# EAGLE design Drum_Machine (EAGLE 9.0.0)
REV: 00

## Sheet 1 of 6: PocketBeagle Connections
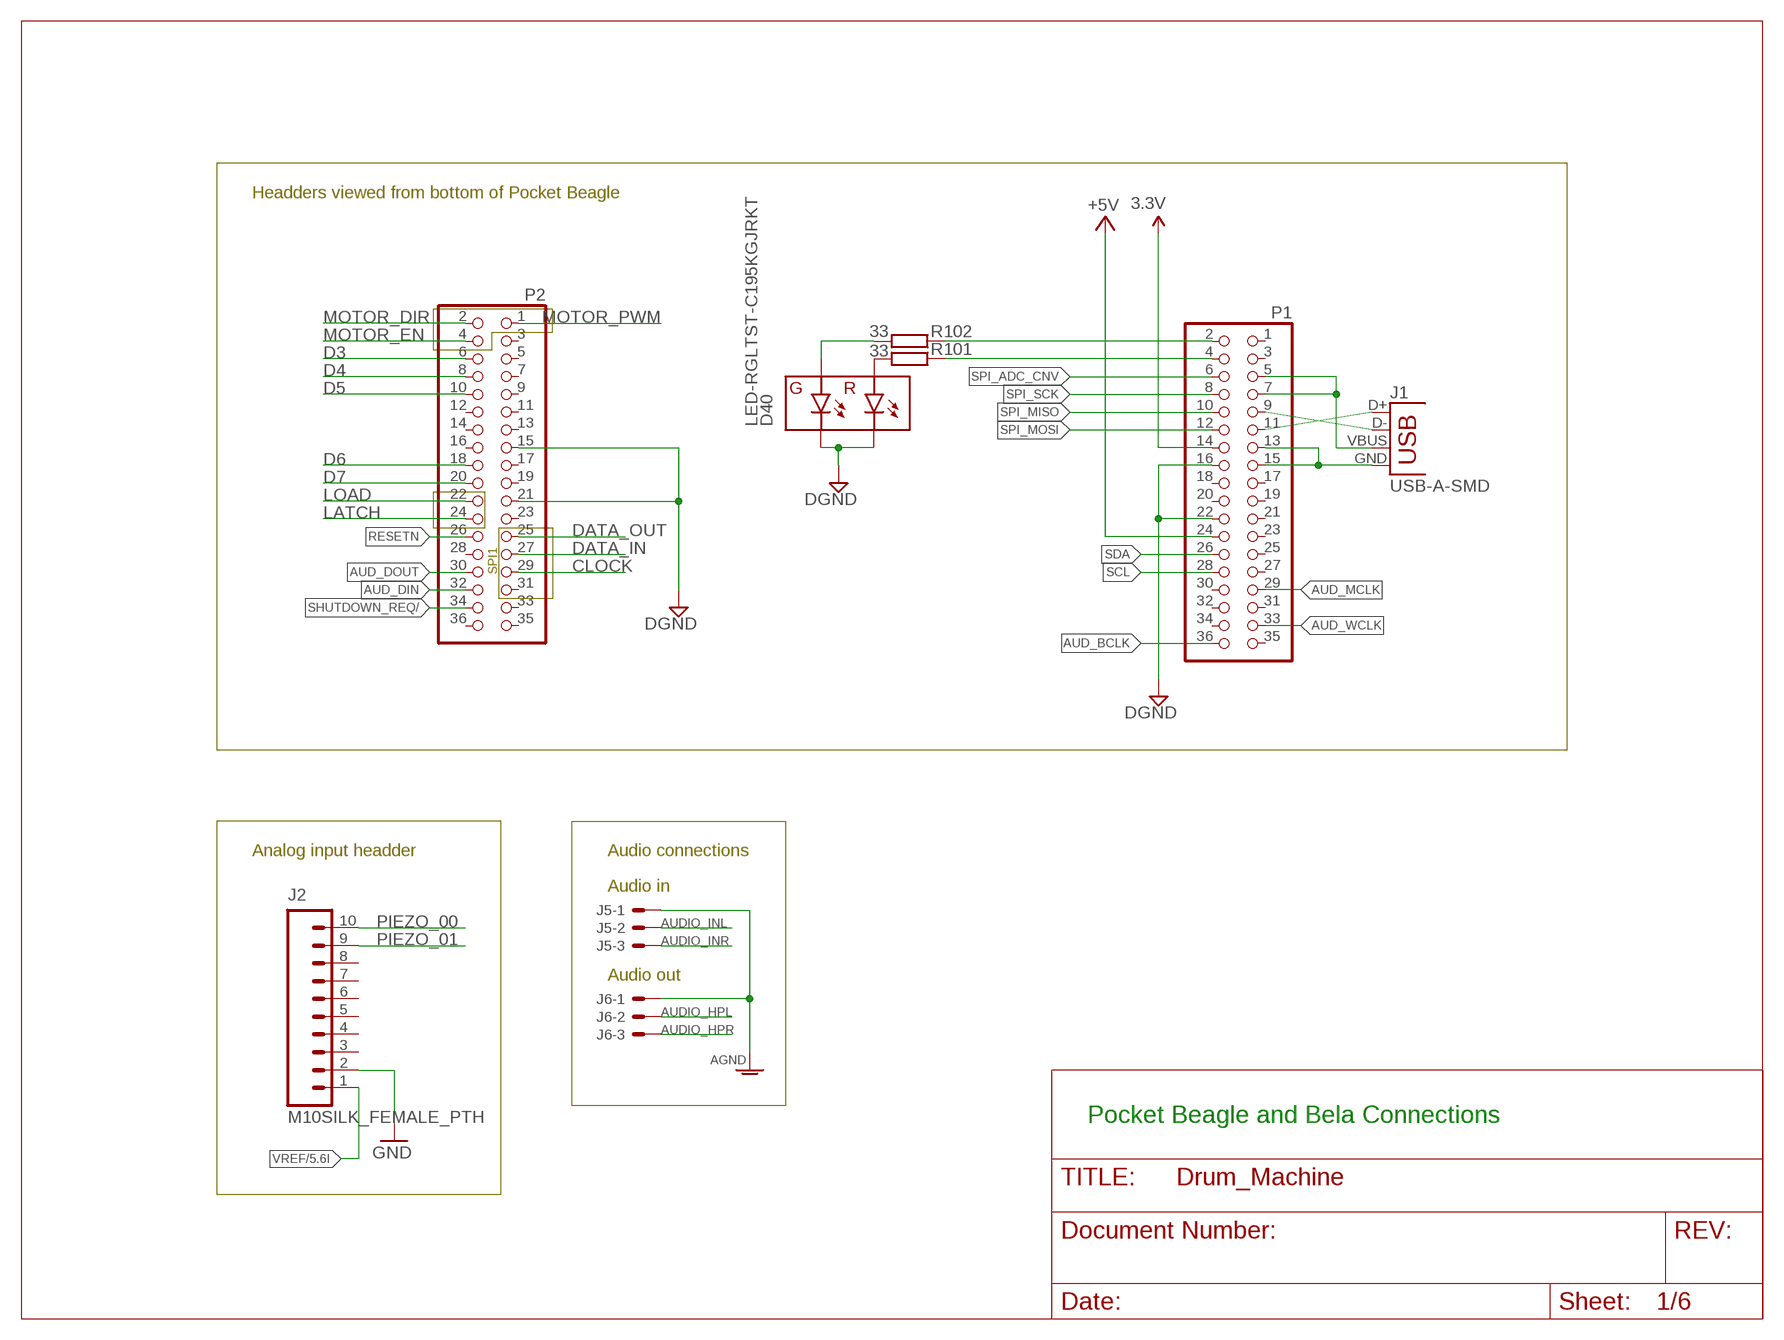
[diagram p0: schematic, sheet 1]

### Parts
D40  LED-RGLTST-C195KGJRKT  [LTST-C195KGJRKT]
J1  USB-A-SMD  [USB-A-S-NOSILK-FEMALE]
J2  M10SILK_FEMALE_PTH  [1X10]
J5  22-23-2031  [22-23-2031]
J6  22-23-2031  [22-23-2031]
P1  PINHD-2X18  [2X18]
P2  PINHD-2X18  [2X18]
R101  33  R-EU_R0603  [R0603]
R102  33  R-EU_R0603  [R0603]

### Nets
3.3V: P1.14 ; also sheet 2,3,4
+5V_SYS: P1.24 ; supply symbol labelled +5V
AUD_BCLK: P1.36
AUD_DIN: P2.32
AUD_DOUT: P2.30
AUD_MCLK: P1.29
AUD_WCLK: P1.33
AUDIO_HPL: J6.2
AUDIO_HPR: J6.3
AUDIO_INL: J5.2
AUDIO_INR: J5.3
CLOCK: P2.29 ; also sheet 2,3,4
D3: P2.6
D4: P2.8
D5: P2.10
D6: P2.18
D7: P2.20
DATA_IN: P2.27
DATA_OUT: P2.25 ; also sheet 2
GND: D40.P$3(GC) D40.P$4(RC) J2.2 J5.1 J6.1 P1.16 P1.22 P2.15 P2.21 ; supply symbol labelled DGND, AGND ; also sheet 2,3,4,5,6
LATCH: P2.24 ; also sheet 2,3
LOAD: P2.22
MOTOR_DIR: P2.2
MOTOR_EN: P2.4
MOTOR_PWM: P2.1
N$134: D40.P$2(RA) R101.2
N$135: D40.P$1(GA) R102.2
N$136: P1.4 R101.1
N$137: P1.2 R102.1
PIEZO_00: J2.10 ; also sheet 5
PIEZO_01: J2.9 ; also sheet 5
RESETN: P2.26
SCL: P1.28
SDA: P1.26
SHUTDOWN_REQ/: P2.34
SPI_ADC_CNV: P1.6
SPI_MISO: P1.10
SPI_MOSI: P1.12
SPI_SCK: P1.8
USB_DM1: J1.D- P1.9
USB_DP1: J1.D+ P1.11
USB_VBUS1: J1.VBUS P1.5 P1.7
USBGND1: J1.GND P1.13 P1.15
VREF: J2.1 ; also sheet 5
Unconnected: J2.3 J2.4 J2.5 J2.6 J2.7 J2.8 P1.1 P1.3 P1.17 P1.18 P1.19 P1.20 P1.21 P1.23 P1.25 P1.27 P1.30 P1.31 P1.32 P1.34 P1.35 P2.3 P2.5 P2.7 P2.9 P2.11 P2.12 P2.13 P2.14 P2.16 P2.17 P2.19 P2.23 P2.28 P2.31 P2.33 P2.35 P2.36

### Notes on the sheet
- Headders viewed from bottom of Pocket Beagle
- SPI1
- Analog input headder | Audio connections
- Audio in
- Audio out
- Pocket Beagle and Bela Connections

## Sheet 2 of 6: LED Matrix
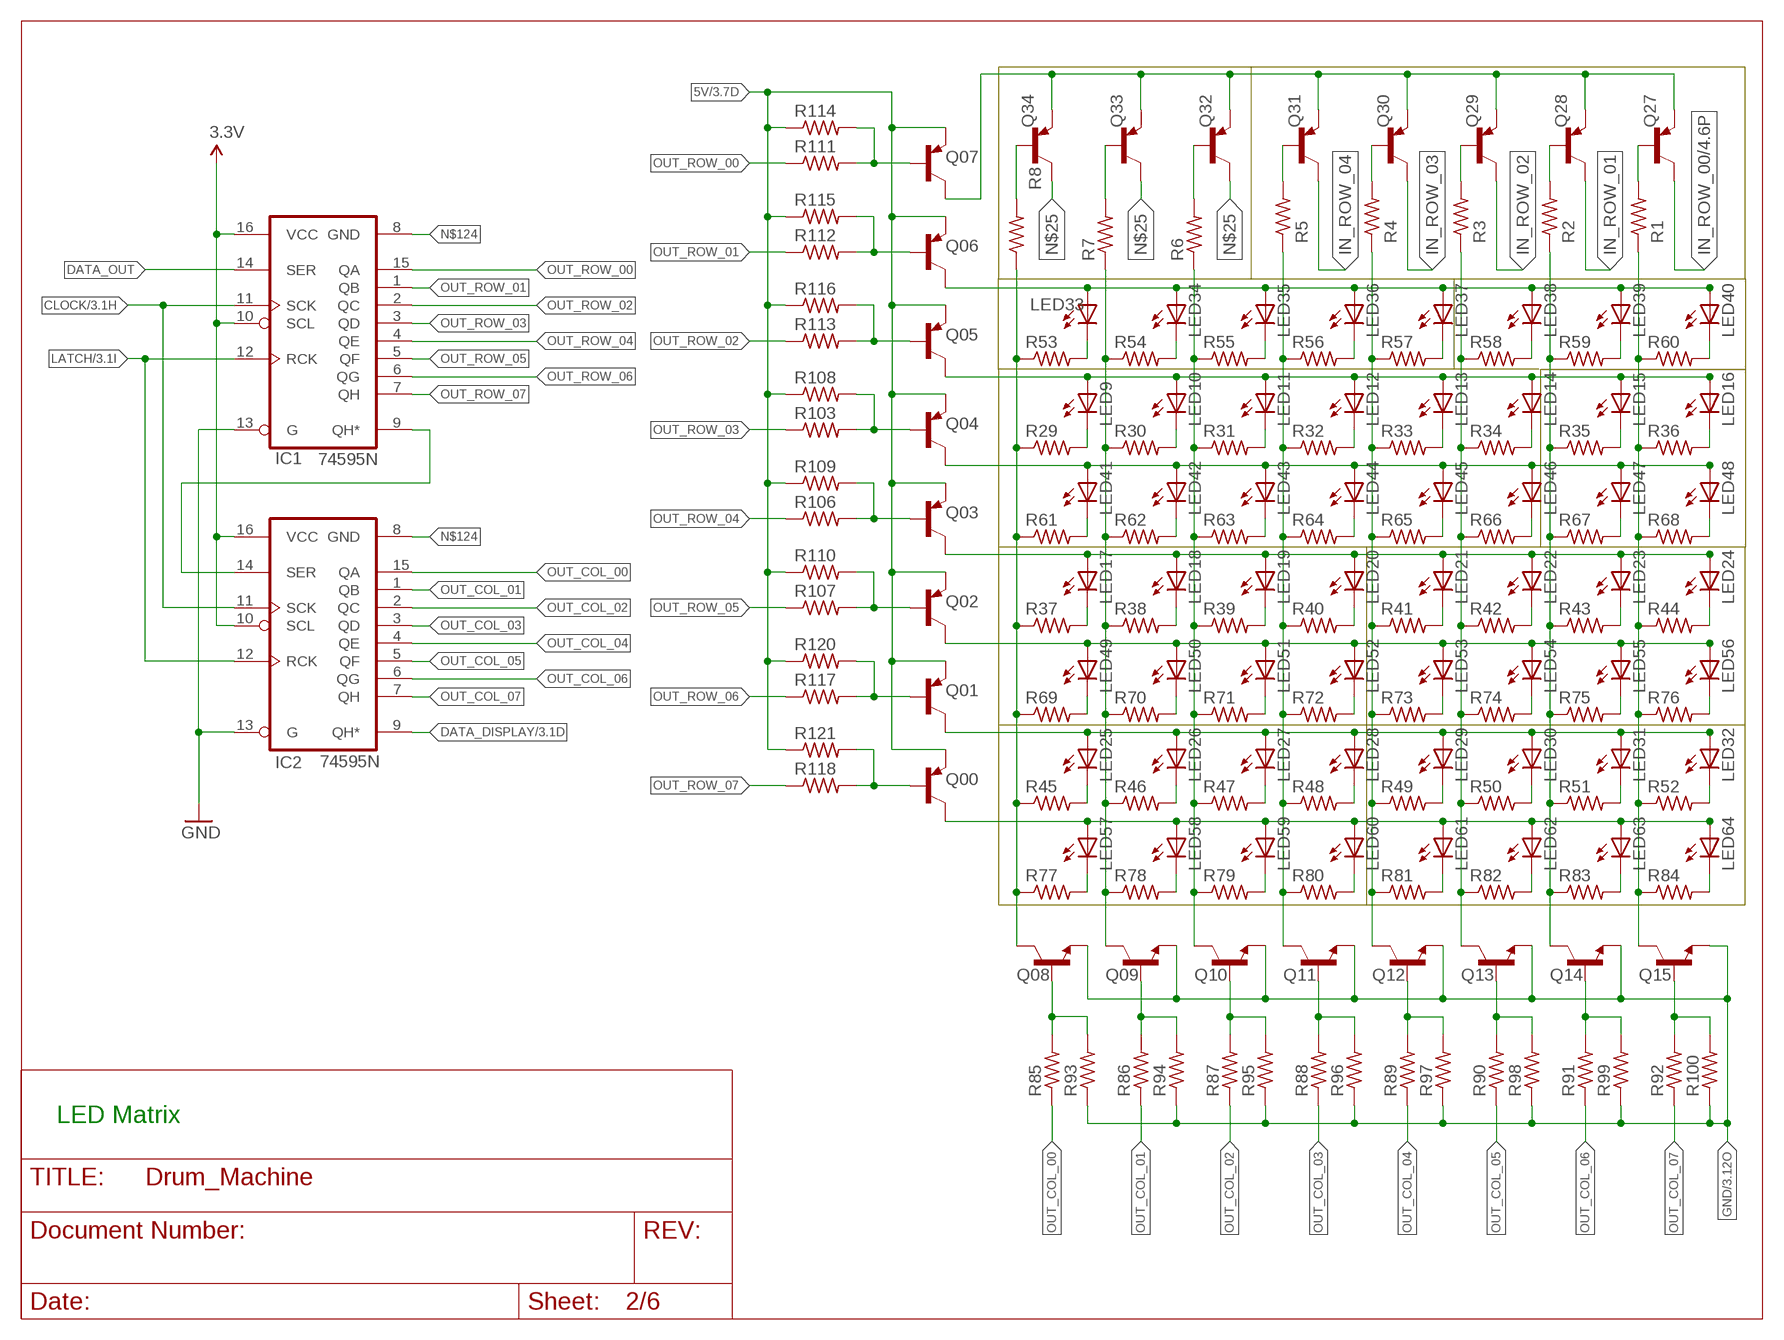
[diagram p1: schematic, sheet 2]

### Parts
IC1  74595N  [DIL16]
IC2  74595N  [DIL16]
LED9  LED5MM  [LED5MM]
LED10  LED5MM  [LED5MM]
LED11  LED5MM  [LED5MM]
LED12  LED5MM  [LED5MM]
LED13  LED5MM  [LED5MM]
LED14  LED5MM  [LED5MM]
LED15  LED5MM  [LED5MM]
LED16  LED5MM  [LED5MM]
LED17  LED5MM  [LED5MM]
LED18  LED5MM  [LED5MM]
LED19  LED5MM  [LED5MM]
LED20  LED5MM  [LED5MM]
LED21  LED5MM  [LED5MM]
LED22  LED5MM  [LED5MM]
LED23  LED5MM  [LED5MM]
LED24  LED5MM  [LED5MM]
LED25  LED5MM  [LED5MM]
LED26  LED5MM  [LED5MM]
LED27  LED5MM  [LED5MM]
LED28  LED5MM  [LED5MM]
LED29  LED5MM  [LED5MM]
LED30  LED5MM  [LED5MM]
LED31  LED5MM  [LED5MM]
LED32  LED5MM  [LED5MM]
LED33  LED5MM  [LED5MM]
LED34  LED5MM  [LED5MM]
LED35  LED5MM  [LED5MM]
LED36  LED5MM  [LED5MM]
LED37  LED5MM  [LED5MM]
LED38  LED5MM  [LED5MM]
LED39  LED5MM  [LED5MM]
LED40  LED5MM  [LED5MM]
LED41  LED5MM  [LED5MM]
LED42  LED5MM  [LED5MM]
LED43  LED5MM  [LED5MM]
LED44  LED5MM  [LED5MM]
LED45  LED5MM  [LED5MM]
LED46  LED5MM  [LED5MM]
LED47  LED5MM  [LED5MM]
LED48  LED5MM  [LED5MM]
LED49  LED5MM  [LED5MM]
LED50  LED5MM  [LED5MM]
LED51  LED5MM  [LED5MM]
LED52  LED5MM  [LED5MM]
LED53  LED5MM  [LED5MM]
LED54  LED5MM  [LED5MM]
LED55  LED5MM  [LED5MM]
LED56  LED5MM  [LED5MM]
LED57  LED5MM  [LED5MM]
LED58  LED5MM  [LED5MM]
LED59  LED5MM  [LED5MM]
LED60  LED5MM  [LED5MM]
LED61  LED5MM  [LED5MM]
LED62  LED5MM  [LED5MM]
LED63  LED5MM  [LED5MM]
LED64  LED5MM  [LED5MM]
Q00  BC857CSMD  [SOT23-BEC]
Q01  BC857CSMD  [SOT23-BEC]
Q02  BC857CSMD  [SOT23-BEC]
Q03  BC857CSMD  [SOT23-BEC]
Q04  BC857CSMD  [SOT23-BEC]
Q05  BC857CSMD  [SOT23-BEC]
Q06  BC857CSMD  [SOT23-BEC]
Q07  BC857CSMD  [SOT23-BEC]
Q08  2N4401-NPN-TO92-EBC  [TO92-EBC]
Q09  2N4401-NPN-TO92-EBC  [TO92-EBC]
Q10  2N4401-NPN-TO92-EBC  [TO92-EBC]
Q11  2N4401-NPN-TO92-EBC  [TO92-EBC]
Q12  2N4401-NPN-TO92-EBC  [TO92-EBC]
Q13  2N4401-NPN-TO92-EBC  [TO92-EBC]
Q14  2N4401-NPN-TO92-EBC  [TO92-EBC]
Q15  2N4401-NPN-TO92-EBC  [TO92-EBC]
Q27  BC857CSMD  [SOT23-BEC]
Q28  BC857CSMD  [SOT23-BEC]
Q29  BC857CSMD  [SOT23-BEC]
Q30  BC857CSMD  [SOT23-BEC]
Q31  BC857CSMD  [SOT23-BEC]
Q32  BC857CSMD  [SOT23-BEC]
Q33  BC857CSMD  [SOT23-BEC]
Q34  BC857CSMD  [SOT23-BEC]
R1  R-US_0309/10  [0309/10]
R2  R-US_0309/10  [0309/10]
R3  R-US_0309/10  [0309/10]
R4  R-US_0309/10  [0309/10]
R5  R-US_0309/10  [0309/10]
R6  R-US_0309/10  [0309/10]
R7  R-US_0309/10  [0309/10]
R8  R-US_0309/10  [0309/10]
R29  R-US_0309/10  [0309/10]
R30  R-US_0309/10  [0309/10]
R31  R-US_0309/10  [0309/10]
R32  R-US_0309/10  [0309/10]
R33  R-US_0309/10  [0309/10]
R34  R-US_0309/10  [0309/10]
R35  R-US_0309/10  [0309/10]
R36  R-US_0309/10  [0309/10]
R37  R-US_0309/10  [0309/10]
R38  R-US_0309/10  [0309/10]
R39  R-US_0309/10  [0309/10]
R40  R-US_0309/10  [0309/10]
R41  R-US_0309/10  [0309/10]
R42  R-US_0309/10  [0309/10]
R43  R-US_0309/10  [0309/10]
R44  R-US_0309/10  [0309/10]
R45  R-US_0309/10  [0309/10]
R46  R-US_0309/10  [0309/10]
R47  R-US_0309/10  [0309/10]
R48  R-US_0309/10  [0309/10]
R49  R-US_0309/10  [0309/10]
R50  R-US_0309/10  [0309/10]
R51  R-US_0309/10  [0309/10]
R52  R-US_0309/10  [0309/10]
R53  R-US_0309/10  [0309/10]
R54  R-US_0309/10  [0309/10]
R55  R-US_0309/10  [0309/10]
R56  R-US_0309/10  [0309/10]
R57  R-US_0309/10  [0309/10]
R58  R-US_0309/10  [0309/10]
R59  R-US_0309/10  [0309/10]
R60  R-US_0309/10  [0309/10]
R61  R-US_0309/10  [0309/10]
R62  R-US_0309/10  [0309/10]
R63  R-US_0309/10  [0309/10]
R64  R-US_0309/10  [0309/10]
R65  R-US_0309/10  [0309/10]
R66  R-US_0309/10  [0309/10]
R67  R-US_0309/10  [0309/10]
R68  R-US_0309/10  [0309/10]
R69  R-US_0309/10  [0309/10]
R70  R-US_0309/10  [0309/10]
R71  R-US_0309/10  [0309/10]
R72  R-US_0309/10  [0309/10]
R73  R-US_0309/10  [0309/10]
R74  R-US_0309/10  [0309/10]
R75  R-US_0309/10  [0309/10]
R76  R-US_0309/10  [0309/10]
R77  R-US_0309/10  [0309/10]
R78  R-US_0309/10  [0309/10]
R79  R-US_0309/10  [0309/10]
R80  R-US_0309/10  [0309/10]
R81  R-US_0309/10  [0309/10]
R82  R-US_0309/10  [0309/10]
R83  R-US_0309/10  [0309/10]
R84  R-US_0309/10  [0309/10]
R85  R-US_0309/10  [0309/10]
R86  R-US_0309/10  [0309/10]
R87  R-US_0309/10  [0309/10]
R88  R-US_0309/10  [0309/10]
R89  R-US_0309/10  [0309/10]
R90  R-US_0309/10  [0309/10]
R91  R-US_0309/10  [0309/10]
R92  R-US_0309/10  [0309/10]
R93  R-US_0309/10  [0309/10]
R94  R-US_0309/10  [0309/10]
R95  R-US_0309/10  [0309/10]
R96  R-US_0309/10  [0309/10]
R97  R-US_0309/10  [0309/10]
R98  R-US_0309/10  [0309/10]
R99  R-US_0309/10  [0309/10]
R100  R-US_0309/10  [0309/10]
R103  R-US_0309/10  [0309/10]
R106  R-US_0309/10  [0309/10]
R107  R-US_0309/10  [0309/10]
R108  R-US_0309/10  [0309/10]
R109  R-US_0309/10  [0309/10]
R110  R-US_0309/10  [0309/10]
R111  R-US_0309/10  [0309/10]
R112  R-US_0309/10  [0309/10]
R113  R-US_0309/10  [0309/10]
R114  R-US_0309/10  [0309/10]
R115  R-US_0309/10  [0309/10]
R116  R-US_0309/10  [0309/10]
R117  R-US_0309/10  [0309/10]
R118  R-US_0309/10  [0309/10]
R120  R-US_0309/10  [0309/10]
R121  R-US_0309/10  [0309/10]

### Nets
3.3V: IC1.10(SCL) IC1.16(VCC) IC2.10(SCL) IC2.16(VCC) ; also sheet 1,3,4
5V: Q00.E Q01.E Q02.E Q03.E Q04.E Q05.E Q06.E Q07.E R108.1 R109.1 R110.1 R114.1 R115.1 R116.1 R120.1 R121.1 ; also sheet 3
4445: Q06.B R112.2 R115.2
CLOCK: IC1.11(SCK) IC2.11(SCK) ; also sheet 1,3,4
DATA_DISPLAY: IC2.9(QH*) ; also sheet 3
DATA_OUT: IC1.14(SER) ; also sheet 1
GND: IC1.13(G) IC2.13(G) Q08.E Q09.E Q10.E Q11.E Q12.E Q13.E Q14.E Q15.E R93.1 R94.1 R95.1 R96.1 R97.1 R98.1 R99.1 R100.1 ; also sheet 1,3,4,5,6
IN_ROW_00: Q27.C ; also sheet 4
IN_ROW_01: Q28.C ; also sheet 4
IN_ROW_02: Q29.C ; also sheet 4
IN_ROW_03: Q30.C ; also sheet 4
IN_ROW_04: Q31.C ; also sheet 4
LATCH: IC1.12(RCK) IC2.12(RCK) ; also sheet 1,3
N$22: Q27.B R1.2
N$23: Q07.C Q27.E Q28.E Q29.E Q30.E Q31.E Q32.E Q33.E Q34.E
N$24: Q28.B R2.2
N$25: Q32.C Q33.C Q34.C
N$26: Q29.B R3.2
N$27: Q30.B R4.2
N$29: Q31.B R5.2
N$34: Q32.B R6.2
N$36: Q33.B R7.2
N$37: LED9.A LED10.A LED11.A LED12.A LED13.A LED14.A LED15.A LED16.A Q05.C
N$40: Q34.B R8.2
N$41: LED9.K(C) R29.2
N$43: LED10.K(C) R30.2
N$45: LED11.K(C) R31.2
N$47: LED12.K(C) R32.2
N$49: LED13.K(C) R33.2
N$51: LED14.K(C) R34.2
N$59: LED15.K(C) R35.2
N$60: LED16.K(C) R36.2
N$61: LED17.A LED18.A LED19.A LED20.A LED21.A LED22.A LED23.A LED24.A Q03.C
N$62: LED17.K(C) R37.2
N$63: LED18.K(C) R38.2
N$64: LED19.K(C) R39.2
N$65: LED20.K(C) R40.2
N$66: LED21.K(C) R41.2
N$67: LED22.K(C) R42.2
N$68: LED23.K(C) R43.2
N$69: LED24.K(C) R44.2
N$70: LED25.A LED26.A LED27.A LED28.A LED29.A LED30.A LED31.A LED32.A Q01.C
N$71: LED25.K(C) R45.2
N$72: LED26.K(C) R46.2
N$73: LED27.K(C) R47.2
N$74: LED28.K(C) R48.2
N$75: LED29.K(C) R49.2
N$76: LED30.K(C) R50.2
N$77: LED31.K(C) R51.2
N$78: LED32.K(C) R52.2
N$79: LED33.A LED34.A LED35.A LED36.A LED37.A LED38.A LED39.A LED40.A Q06.C
N$80: LED33.K(C) R53.2
N$81: LED34.K(C) R54.2
N$82: LED35.K(C) R55.2
N$83: LED36.K(C) R56.2
N$84: LED37.K(C) R57.2
N$85: LED38.K(C) R58.2
N$86: LED39.K(C) R59.2
N$87: LED40.K(C) R60.2
N$88: LED41.A LED42.A LED43.A LED44.A LED45.A LED46.A LED47.A LED48.A Q04.C
N$89: LED41.K(C) R61.2
N$90: LED42.K(C) R62.2
N$91: LED43.K(C) R63.2
N$92: LED44.K(C) R64.2
N$93: LED45.K(C) R65.2
N$94: LED46.K(C) R66.2
N$95: LED47.K(C) R67.2
N$96: LED48.K(C) R68.2
N$97: LED49.A LED50.A LED51.A LED52.A LED53.A LED54.A LED55.A LED56.A Q02.C
N$98: LED49.K(C) R69.2
N$99: LED50.K(C) R70.2
N$100: LED51.K(C) R71.2
N$101: LED52.K(C) R72.2
N$102: LED53.K(C) R73.2
N$103: LED54.K(C) R74.2
N$104: LED55.K(C) R75.2
N$105: LED56.K(C) R76.2
N$106: LED57.A LED58.A LED59.A LED60.A LED61.A LED62.A LED63.A LED64.A Q00.C
N$107: LED57.K(C) R77.2
N$108: LED58.K(C) R78.2
N$109: LED59.K(C) R79.2
N$110: LED60.K(C) R80.2
N$111: LED61.K(C) R81.2
N$112: LED62.K(C) R82.2
N$113: LED63.K(C) R83.2
N$114: LED64.K(C) R84.2
N$115: Q08.C R8.1 R29.1 R37.1 R45.1 R53.1 R61.1 R69.1 R77.1
N$116: Q09.C R7.1 R30.1 R38.1 R46.1 R54.1 R62.1 R70.1 R78.1
N$117: Q10.C R6.1 R31.1 R39.1 R47.1 R55.1 R63.1 R71.1 R79.1
N$118: Q11.C R5.1 R32.1 R40.1 R48.1 R56.1 R64.1 R72.1 R80.1
N$119: Q12.C R4.1 R33.1 R41.1 R49.1 R57.1 R65.1 R73.1 R81.1
N$120: Q13.C R3.1 R34.1 R42.1 R50.1 R58.1 R66.1 R74.1 R82.1
N$121: Q14.C R2.1 R35.1 R43.1 R51.1 R59.1 R67.1 R75.1 R83.1
N$122: Q15.C R1.1 R36.1 R44.1 R52.1 R60.1 R68.1 R76.1 R84.1
N$123: Q08.B R85.2 R93.2
N$124: IC1.8(GND) IC2.8(GND)
N$125: Q09.B R86.2 R94.2
N$126: Q10.B R87.2 R95.2
N$127: Q11.B R88.2 R96.2
N$128: Q12.B R89.2 R97.2
N$129: Q13.B R90.2 R98.2
N$130: Q14.B R91.2 R99.2
N$131: Q15.B R92.2 R100.2
N$132: IC1.9(QH*) IC2.14(SER)
N$133: Q04.B R103.2 R108.2
N$138: Q03.B R106.2 R109.2
N$139: Q02.B R107.2 R110.2
N$140: Q07.B R111.2 R114.2
N$142: Q05.B R113.2 R116.2
N$143: Q01.B R117.2 R120.2
N$144: Q00.B R118.2 R121.2
OUT_COL_00: IC2.15(QA) R85.1
OUT_COL_01: IC2.1(QB) R86.1
OUT_COL_02: IC2.2(QC) R87.1
OUT_COL_03: IC2.3(QD) R88.1
OUT_COL_04: IC2.4(QE) R89.1
OUT_COL_05: IC2.5(QF) R90.1
OUT_COL_06: IC2.6(QG) R91.1
OUT_COL_07: IC2.7(QH) R92.1
OUT_ROW_00: IC1.15(QA) R111.1
OUT_ROW_01: IC1.1(QB) R112.1
OUT_ROW_02: IC1.2(QC) R113.1
OUT_ROW_03: IC1.3(QD) R103.1
OUT_ROW_04: IC1.4(QE) R106.1
OUT_ROW_05: IC1.5(QF) R107.1
OUT_ROW_06: IC1.6(QG) R117.1
OUT_ROW_07: IC1.7(QH) R118.1

### Notes on the sheet
- LED Matrix

## Sheet 3 of 6: Numeric Display
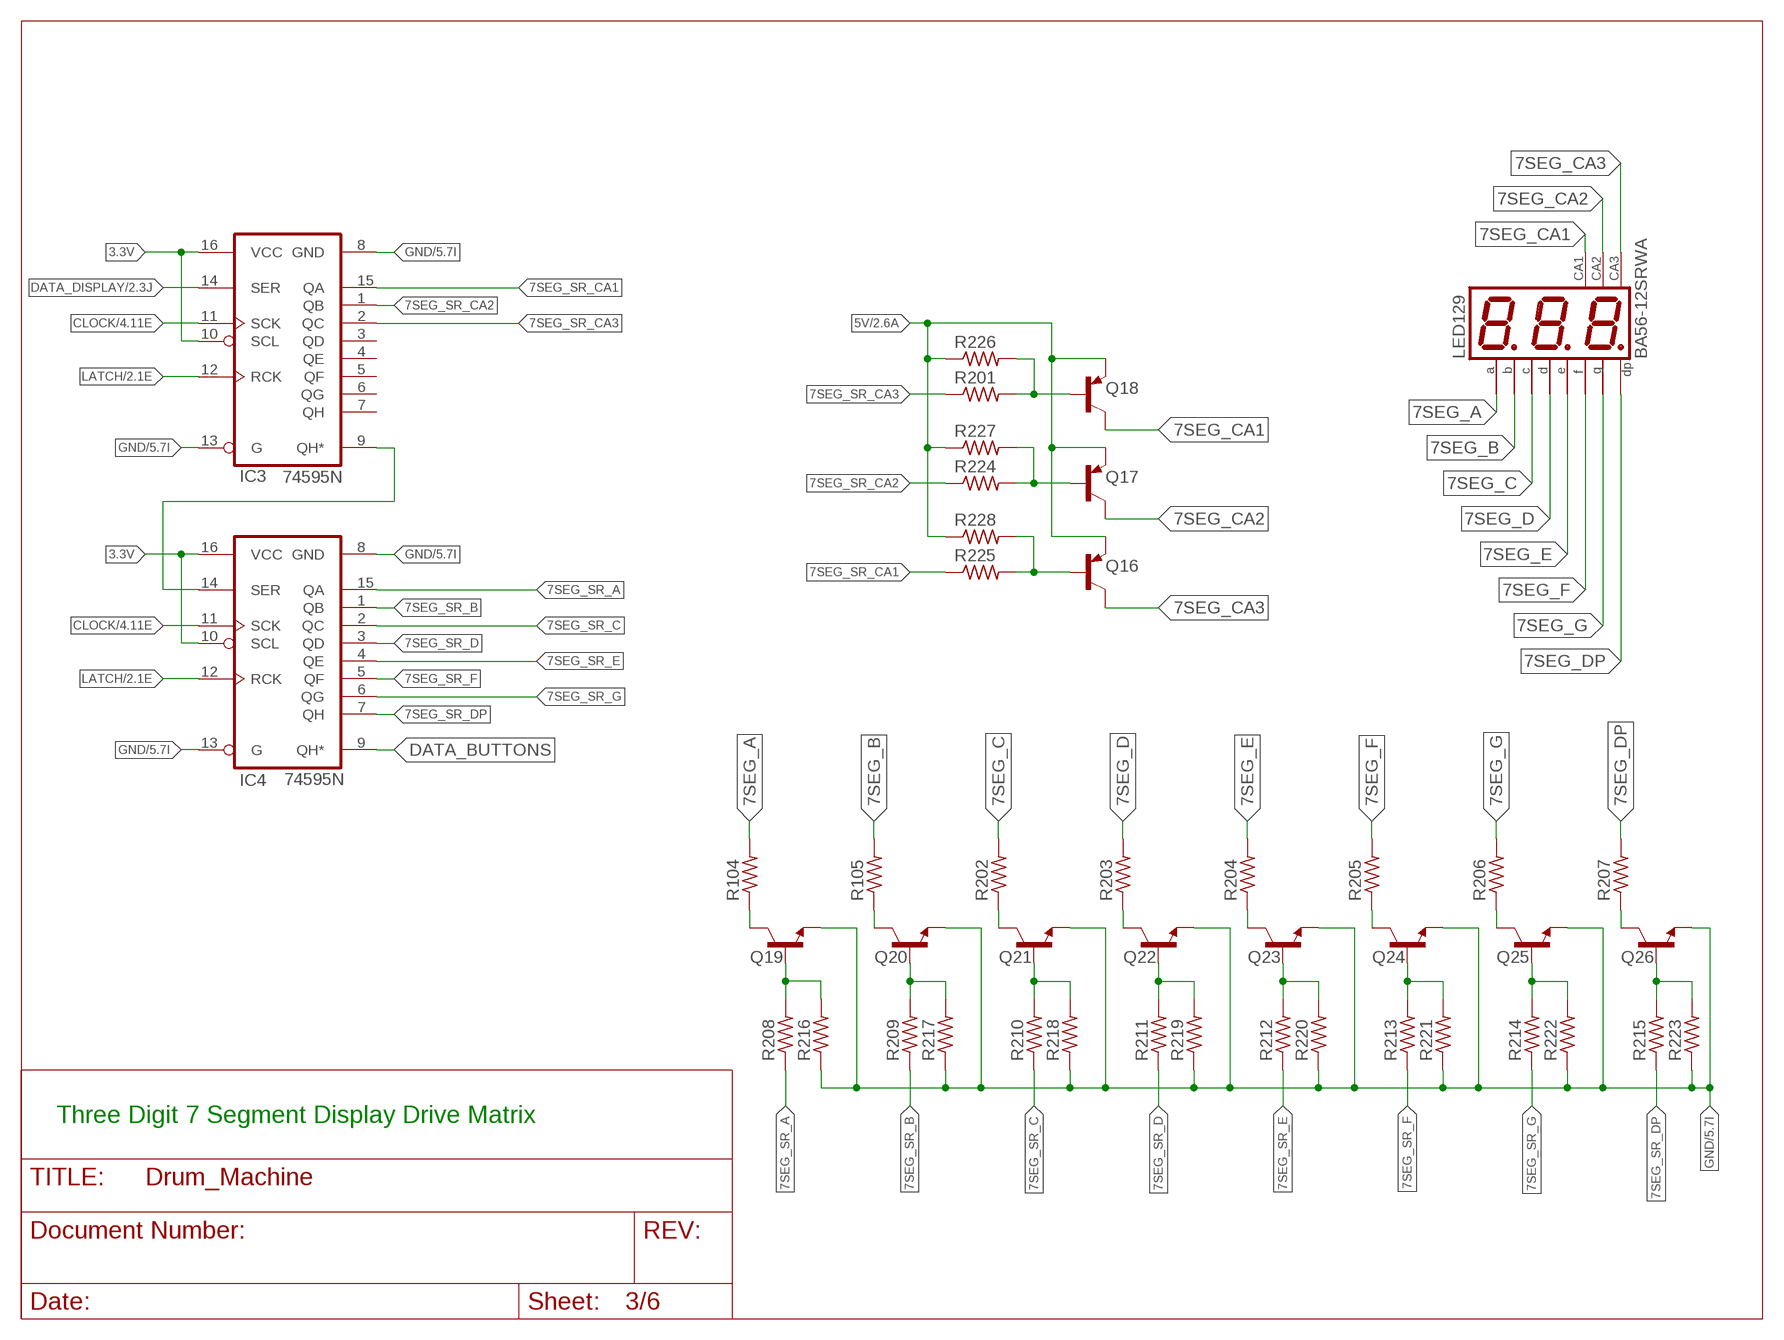
[diagram p2: schematic, sheet 3]

### Parts
IC3  74595N  [DIL16]
IC4  74595N  [DIL16]
LED129  BA56-12SRWA  [BX56-12]
Q16  BC857CSMD  [SOT23-BEC]
Q17  BC857CSMD  [SOT23-BEC]
Q18  BC857CSMD  [SOT23-BEC]
Q19  2N4401-NPN-TO92-EBC  [TO92-EBC]
Q20  2N4401-NPN-TO92-EBC  [TO92-EBC]
Q21  2N4401-NPN-TO92-EBC  [TO92-EBC]
Q22  2N4401-NPN-TO92-EBC  [TO92-EBC]
Q23  2N4401-NPN-TO92-EBC  [TO92-EBC]
Q24  2N4401-NPN-TO92-EBC  [TO92-EBC]
Q25  2N4401-NPN-TO92-EBC  [TO92-EBC]
Q26  2N4401-NPN-TO92-EBC  [TO92-EBC]
R104  R-US_0309/10  [0309/10]
R105  R-US_0309/10  [0309/10]
R201  R-US_0309/10  [0309/10]
R202  R-US_0309/10  [0309/10]
R203  R-US_0309/10  [0309/10]
R204  R-US_0309/10  [0309/10]
R205  R-US_0309/10  [0309/10]
R206  R-US_0309/10  [0309/10]
R207  R-US_0309/10  [0309/10]
R208  R-US_0309/10  [0309/10]
R209  R-US_0309/10  [0309/10]
R210  R-US_0309/10  [0309/10]
R211  R-US_0309/10  [0309/10]
R212  R-US_0309/10  [0309/10]
R213  R-US_0309/10  [0309/10]
R214  R-US_0309/10  [0309/10]
R215  R-US_0309/10  [0309/10]
R216  R-US_0309/10  [0309/10]
R217  R-US_0309/10  [0309/10]
R218  R-US_0309/10  [0309/10]
R219  R-US_0309/10  [0309/10]
R220  R-US_0309/10  [0309/10]
R221  R-US_0309/10  [0309/10]
R222  R-US_0309/10  [0309/10]
R223  R-US_0309/10  [0309/10]
R224  R-US_0309/10  [0309/10]
R225  R-US_0309/10  [0309/10]
R226  R-US_0309/10  [0309/10]
R227  R-US_0309/10  [0309/10]
R228  R-US_0309/10  [0309/10]

### Nets
3.3V: IC3.10(SCL) IC3.16(VCC) IC4.10(SCL) IC4.16(VCC) ; also sheet 1,2,4
5V: Q16.E Q17.E Q18.E R226.1 R227.1 R228.1 ; also sheet 2
7SEG_A: LED129.11(A) R104.2
7SEG_B: LED129.7(B) R105.2
7SEG_C: LED129.4(C) R202.2
7SEG_CA1: LED129.12(CA) Q18.C
7SEG_CA2: LED129.9(CA) Q17.C
7SEG_CA3: LED129.8(CA) Q16.C
7SEG_D: LED129.2(D) R203.2
7SEG_DP: LED129.3(DP) R207.2
7SEG_E: LED129.1(E) R204.2
7SEG_F: LED129.10(F) R205.2
7SEG_G: LED129.5(G) R206.2
7SEG_SR_A: IC4.15(QA) R208.1
7SEG_SR_B: IC4.1(QB) R209.1
7SEG_SR_C: IC4.2(QC) R210.1
7SEG_SR_CA1: IC3.15(QA) R225.1
7SEG_SR_CA2: IC3.1(QB) R224.1
7SEG_SR_CA3: IC3.2(QC) R201.1
7SEG_SR_D: IC4.3(QD) R211.1
7SEG_SR_DP: IC4.7(QH) R215.1
7SEG_SR_E: IC4.4(QE) R212.1
7SEG_SR_F: IC4.5(QF) R213.1
7SEG_SR_G: IC4.6(QG) R214.1
CLOCK: IC3.11(SCK) IC4.11(SCK) ; also sheet 1,2,4
DATA_BUTTONS: IC4.9(QH*)
DATA_DISPLAY: IC3.14(SER) ; also sheet 2
GND: IC3.8(GND) IC3.13(G) IC4.8(GND) IC4.13(G) Q19.E Q20.E Q21.E Q22.E Q23.E Q24.E Q25.E Q26.E R216.1 R217.1 R218.1 R219.1 R220.1 R221.1 R222.1 R223.1 ; also sheet 1,2,4,5,6
LATCH: IC3.12(RCK) IC4.12(RCK) ; also sheet 1,2
N$33: IC3.9(QH*) IC4.14(SER)
N$238: Q18.B R201.2 R226.2
N$241: Q19.C R104.1
N$242: Q20.C R105.1
N$243: Q21.C R202.1
N$244: Q22.C R203.1
N$245: Q23.C R204.1
N$246: Q24.C R205.1
N$247: Q25.C R206.1
N$248: Q26.C R207.1
N$249: Q19.B R208.2 R216.2
N$250: Q20.B R209.2 R217.2
N$251: Q21.B R210.2 R218.2
N$252: Q22.B R211.2 R219.2
N$253: Q23.B R212.2 R220.2
N$254: Q24.B R213.2 R221.2
N$255: Q25.B R214.2 R222.2
N$256: Q26.B R215.2 R223.2
N$258: Q17.B R224.2 R227.2
N$259: Q16.B R225.2 R228.2
Unconnected: IC3.3(QD) IC3.4(QE) IC3.5(QF) IC3.6(QG) IC3.7(QH)

### Notes on the sheet
- Three Digit 7 Segment Display Drive Matrix

## Sheet 4 of 6: Button Matrix
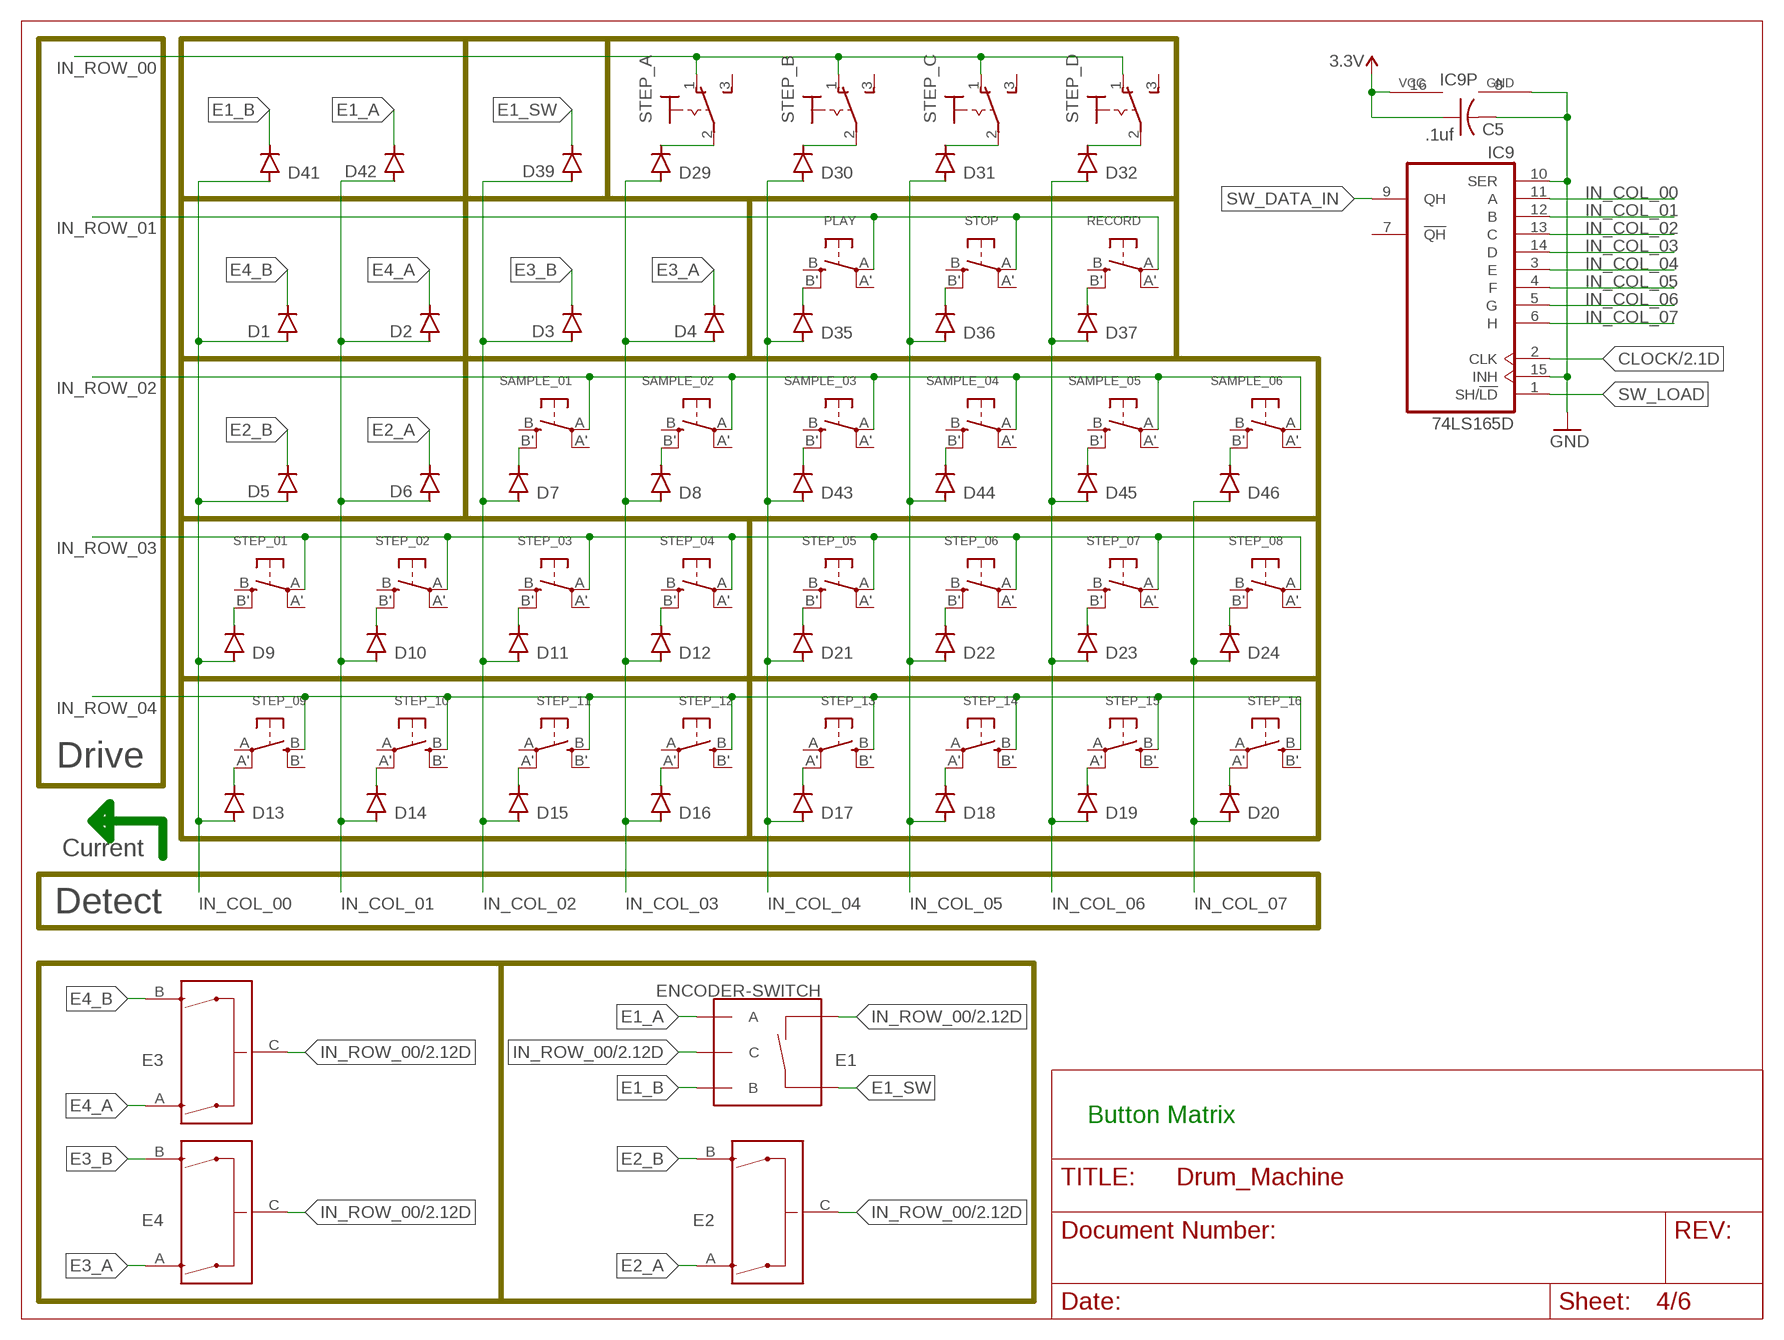
[diagram p3: schematic, sheet 4]

### Parts
C5  .1uf  C-USC0805  [C0805]
D1  PMLL4150  [SOD80C@1]
D2  PMLL4150  [SOD80C@1]
D3  PMLL4150  [SOD80C@1]
D4  PMLL4150  [SOD80C@1]
D5  PMLL4150  [SOD80C@1]
D6  PMLL4150  [SOD80C@1]
D7  PMLL4150  [SOD80C@1]
D8  PMLL4150  [SOD80C@1]
D9  PMLL4150  [SOD80C@1]
D10  PMLL4150  [SOD80C@1]
D11  PMLL4150  [SOD80C@1]
D12  PMLL4150  [SOD80C@1]
D13  PMLL4150  [SOD80C@1]
D14  PMLL4150  [SOD80C@1]
D15  PMLL4150  [SOD80C@1]
D16  PMLL4150  [SOD80C@1]
D17  PMLL4150  [SOD80C@1]
D18  PMLL4150  [SOD80C@1]
D19  PMLL4150  [SOD80C@1]
D20  PMLL4150  [SOD80C@1]
D21  PMLL4150  [SOD80C@1]
D22  PMLL4150  [SOD80C@1]
D23  PMLL4150  [SOD80C@1]
D24  PMLL4150  [SOD80C@1]
D29  PMLL4150  [SOD80C@1]
D30  PMLL4150  [SOD80C@1]
D31  PMLL4150  [SOD80C@1]
D32  PMLL4150  [SOD80C@1]
D35  PMLL4150  [SOD80C@1]
D36  PMLL4150  [SOD80C@1]
D37  PMLL4150  [SOD80C@1]
D39  PMLL4150  [SOD80C@1]
D41  PMLL4150  [SOD80C@1]
D42  PMLL4150  [SOD80C@1]
D43  PMLL4150  [SOD80C@1]
D44  PMLL4150  [SOD80C@1]
D45  PMLL4150  [SOD80C@1]
D46  PMLL4150  [SOD80C@1]
E1  ENCODER-SWITCH  [ROTARY_ENC_PLAIN]
E2  ENCODER  [ENCODER-16MM-QUAD]
E3  ENCODER  [ENCODER-16MM-QUAD]
E4  ENCODER  [ENCODER-16MM-QUAD]
IC9  74LS165D  [SO16]
PLAY  SWITCH_TACT_SMT  [EVQ-Q2]
RECORD  SWITCH_TACT_SMT  [EVQ-Q2]
SAMPLE_01  SWITCH_TACT_SMT  [EVQ-Q2]
SAMPLE_02  SWITCH_TACT_SMT  [EVQ-Q2]
SAMPLE_03  SWITCH_TACT_SMT  [EVQ-Q2]
SAMPLE_04  SWITCH_TACT_SMT  [EVQ-Q2]
SAMPLE_05  SWITCH_TACT_SMT  [EVQ-Q2]
SAMPLE_06  SWITCH_TACT_SMT  [EVQ-Q2]
STEP_01  SWITCH_TACT_SMT  [EVQ-Q2]
STEP_02  SWITCH_TACT_SMT  [EVQ-Q2]
STEP_03  SWITCH_TACT_SMT  [EVQ-Q2]
STEP_04  SWITCH_TACT_SMT  [EVQ-Q2]
STEP_05  SWITCH_TACT_SMT  [EVQ-Q2]
STEP_06  SWITCH_TACT_SMT  [EVQ-Q2]
STEP_07  SWITCH_TACT_SMT  [EVQ-Q2]
STEP_08  SWITCH_TACT_SMT  [EVQ-Q2]
STEP_09  SWITCH_TACT_SMT  [EVQ-Q2]
STEP_10  SWITCH_TACT_SMT  [EVQ-Q2]
STEP_11  SWITCH_TACT_SMT  [EVQ-Q2]
STEP_12  SWITCH_TACT_SMT  [EVQ-Q2]
STEP_13  SWITCH_TACT_SMT  [EVQ-Q2]
STEP_14  SWITCH_TACT_SMT  [EVQ-Q2]
STEP_15  SWITCH_TACT_SMT  [EVQ-Q2]
STEP_16  SWITCH_TACT_SMT  [EVQ-Q2]
STEP_A  320-916  [320-916]
STEP_B  320-916  [320-916]
STEP_C  320-916  [320-916]
STEP_D  320-916  [320-916]
STOP  SWITCH_TACT_SMT  [EVQ-Q2]

### Nets
3.3V: C5.1 IC9.16(VCC) ; also sheet 1,2,3
CLOCK: IC9.2(CLK) ; also sheet 1,2,3
E1_A: D42.C E1.A
E1_B: D41.C E1.B
E1_SW: D39.C E1.SW+
E2_A: D6.C E2.A
E2_B: D5.C E2.B
E3_A: D4.C E4.A
E3_B: D3.C E4.B
E4_A: D2.C E3.A
E4_B: D1.C E3.B
GND: C5.2 IC9.8(GND) IC9.10(SER) IC9.15(INH) ; also sheet 1,2,3,5,6
IN_COL_00: D1.A D5.A D9.A D13.A D41.A IC9.11(A)
IN_COL_01: D2.A D6.A D10.A D14.A D42.A IC9.12(B)
IN_COL_02: D3.A D7.A D11.A D15.A D39.A IC9.13(C)
IN_COL_03: D4.A D8.A D12.A D16.A D29.A IC9.14(D)
IN_COL_04: D17.A D21.A D30.A D35.A D43.A IC9.3(E)
IN_COL_05: D18.A D22.A D31.A D36.A D44.A IC9.4(F)
IN_COL_06: D19.A D23.A D32.A D37.A D45.A IC9.5(G)
IN_COL_07: D20.A D24.A D46.A IC9.6(H)
IN_ROW_00: E1.C E1.SW- E2.C E3.C E4.C STEP_A.1(O) STEP_B.1(O) STEP_C.1(O) STEP_D.1(O) ; also sheet 2
IN_ROW_01: PLAY.A(P) RECORD.A(P) STOP.A(P) ; also sheet 2
IN_ROW_02: SAMPLE_01.A(P) SAMPLE_02.A(P) SAMPLE_03.A(P) SAMPLE_04.A(P) SAMPLE_05.A(P) SAMPLE_06.A(P) ; also sheet 2
IN_ROW_03: STEP_01.A(P) STEP_02.A(P) STEP_03.A(P) STEP_04.A(P) STEP_05.A(P) STEP_06.A(P) STEP_07.A(P) STEP_08.A(P) ; also sheet 2
IN_ROW_04: STEP_09.B(S) STEP_10.B(S) STEP_11.B(S) STEP_12.B(S) STEP_13.B(S) STEP_14.B(S) STEP_15.B(S) STEP_16.B(S) ; also sheet 2
N$2: D29.C STEP_A.2(P)
N$3: D16.C STEP_12.A'(P1)
N$4: D17.C STEP_13.A'(P1)
N$5: D18.C STEP_14.A'(P1)
N$6: D15.C STEP_11.A'(P1)
N$7: D14.C STEP_10.A'(P1)
N$8: D13.C STEP_09.A'(P1)
N$9: D19.C STEP_15.A'(P1)
N$10: D20.C STEP_16.A'(P1)
N$11: D30.C STEP_B.2(P)
N$12: D9.C STEP_01.B'(S1)
N$13: D10.C STEP_02.B'(S1)
N$14: D11.C STEP_03.B'(S1)
N$15: D12.C STEP_04.B'(S1)
N$16: D21.C STEP_05.B'(S1)
N$17: D22.C STEP_06.B'(S1)
N$18: D23.C STEP_07.B'(S1)
N$19: D24.C STEP_08.B'(S1)
N$20: D31.C STEP_C.2(P)
N$21: D32.C STEP_D.2(P)
N$28: D35.C PLAY.B'(S1)
N$31: D37.C RECORD.B'(S1)
N$32: D36.C STOP.B'(S1)
N$58: D7.C SAMPLE_01.B'(S1)
N$145: D8.C SAMPLE_02.B'(S1)
N$146: D43.C SAMPLE_03.B'(S1)
N$147: D44.C SAMPLE_04.B'(S1)
N$148: D45.C SAMPLE_05.B'(S1)
N$149: D46.C SAMPLE_06.B'(S1)
SW_DATA_IN: IC9.9(QH)
SW_LOAD: IC9.1(SH/!LD)
Unconnected: IC9.7(!QH) PLAY.A'(P1) PLAY.B(S) RECORD.A'(P1) RECORD.B(S) SAMPLE_01.A'(P1) SAMPLE_01.B(S) SAMPLE_02.A'(P1) SAMPLE_02.B(S) SAMPLE_03.A'(P1) SAMPLE_03.B(S) SAMPLE_04.A'(P1) SAMPLE_04.B(S) SAMPLE_05.A'(P1) SAMPLE_05.B(S) SAMPLE_06.A'(P1) SAMPLE_06.B(S) STEP_01.A'(P1) STEP_01.B(S) STEP_02.A'(P1) STEP_02.B(S) STEP_03.A'(P1) STEP_03.B(S) STEP_04.A'(P1) STEP_04.B(S) STEP_05.A'(P1) STEP_05.B(S) STEP_06.A'(P1) STEP_06.B(S) STEP_07.A'(P1) STEP_07.B(S) STEP_08.A'(P1) STEP_08.B(S) STEP_09.A(P) STEP_09.B'(S1) STEP_10.A(P) STEP_10.B'(S1) STEP_11.A(P) STEP_11.B'(S1) STEP_12.A(P) STEP_12.B'(S1) STEP_13.A(P) STEP_13.B'(S1) STEP_14.A(P) STEP_14.B'(S1) STEP_15.A(P) STEP_15.B'(S1) STEP_16.A(P) STEP_16.B'(S1) STEP_A.3(S) STEP_B.3(S) STEP_C.3(S) STEP_D.3(S) STOP.A'(P1) STOP.B(S)

### Notes on the sheet
- Drive
- Current
- Detect
- Button Matrix

## Sheet 5 of 6: Drum Pads
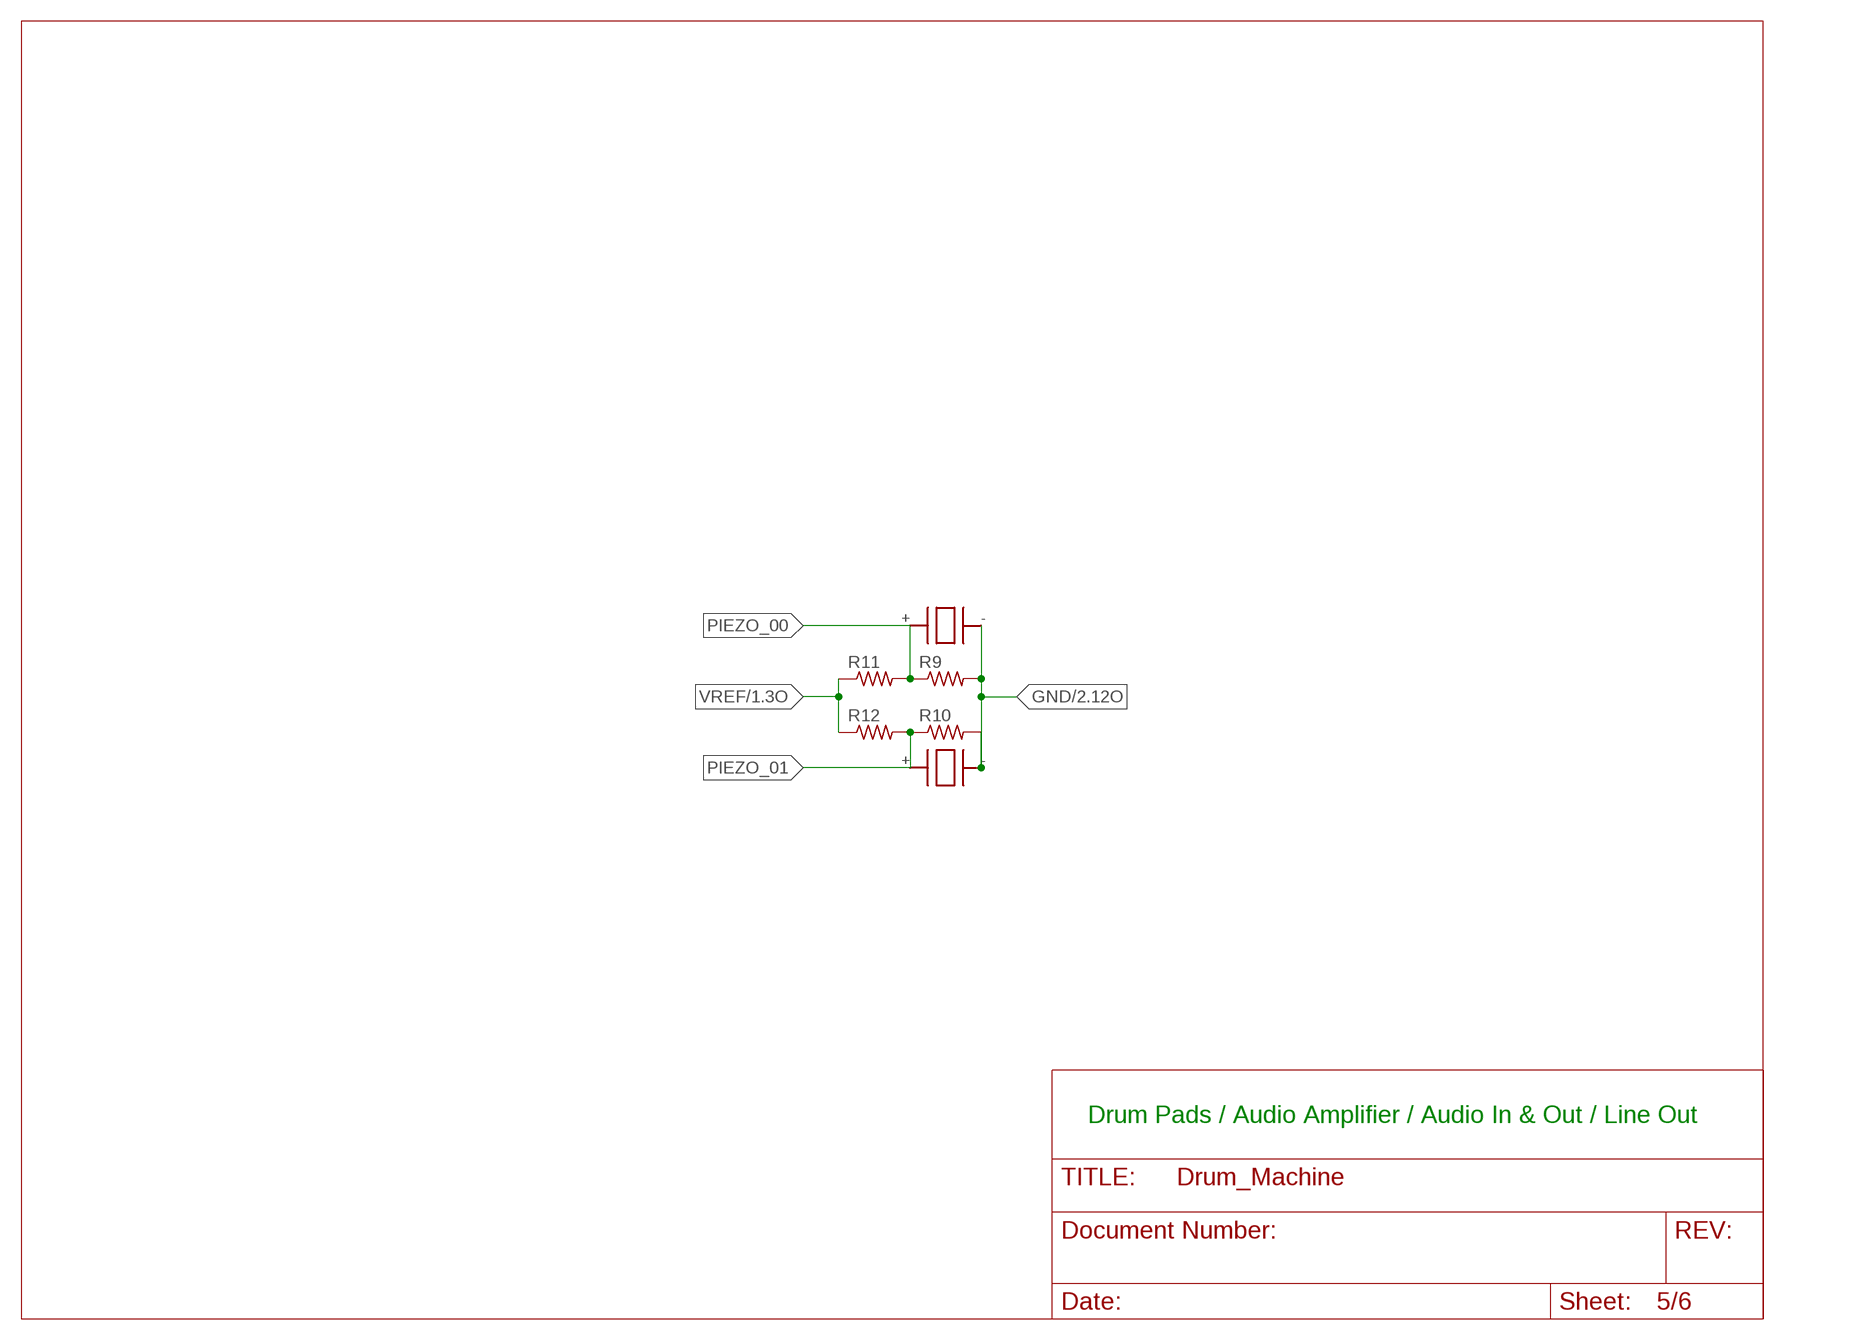
[diagram p4: schematic, sheet 5]

### Parts
R9  R-US_0204/5  [0204/5]
R10  R-US_0204/5  [0204/5]
R11  R-US_0204/5  [0204/5]
R12  R-US_0204/5  [0204/5]
U$1  TRANSDUCER  [DIAPHRAGM]
U$2  TRANSDUCER  [DIAPHRAGM]

### Nets
GND: R9.2 R10.2 U$1.- U$2.- ; also sheet 1,2,3,4,6
PIEZO_00: R9.1 R11.2 U$2.+ ; also sheet 1
PIEZO_01: R10.1 R12.2 U$1.+ ; also sheet 1
VREF: R11.1 R12.1 ; also sheet 1

### Notes on the sheet
- Drum Pads / Audio Amplifier / Audio In & Out / Line Out

## Sheet 6 of 6: Power Supply
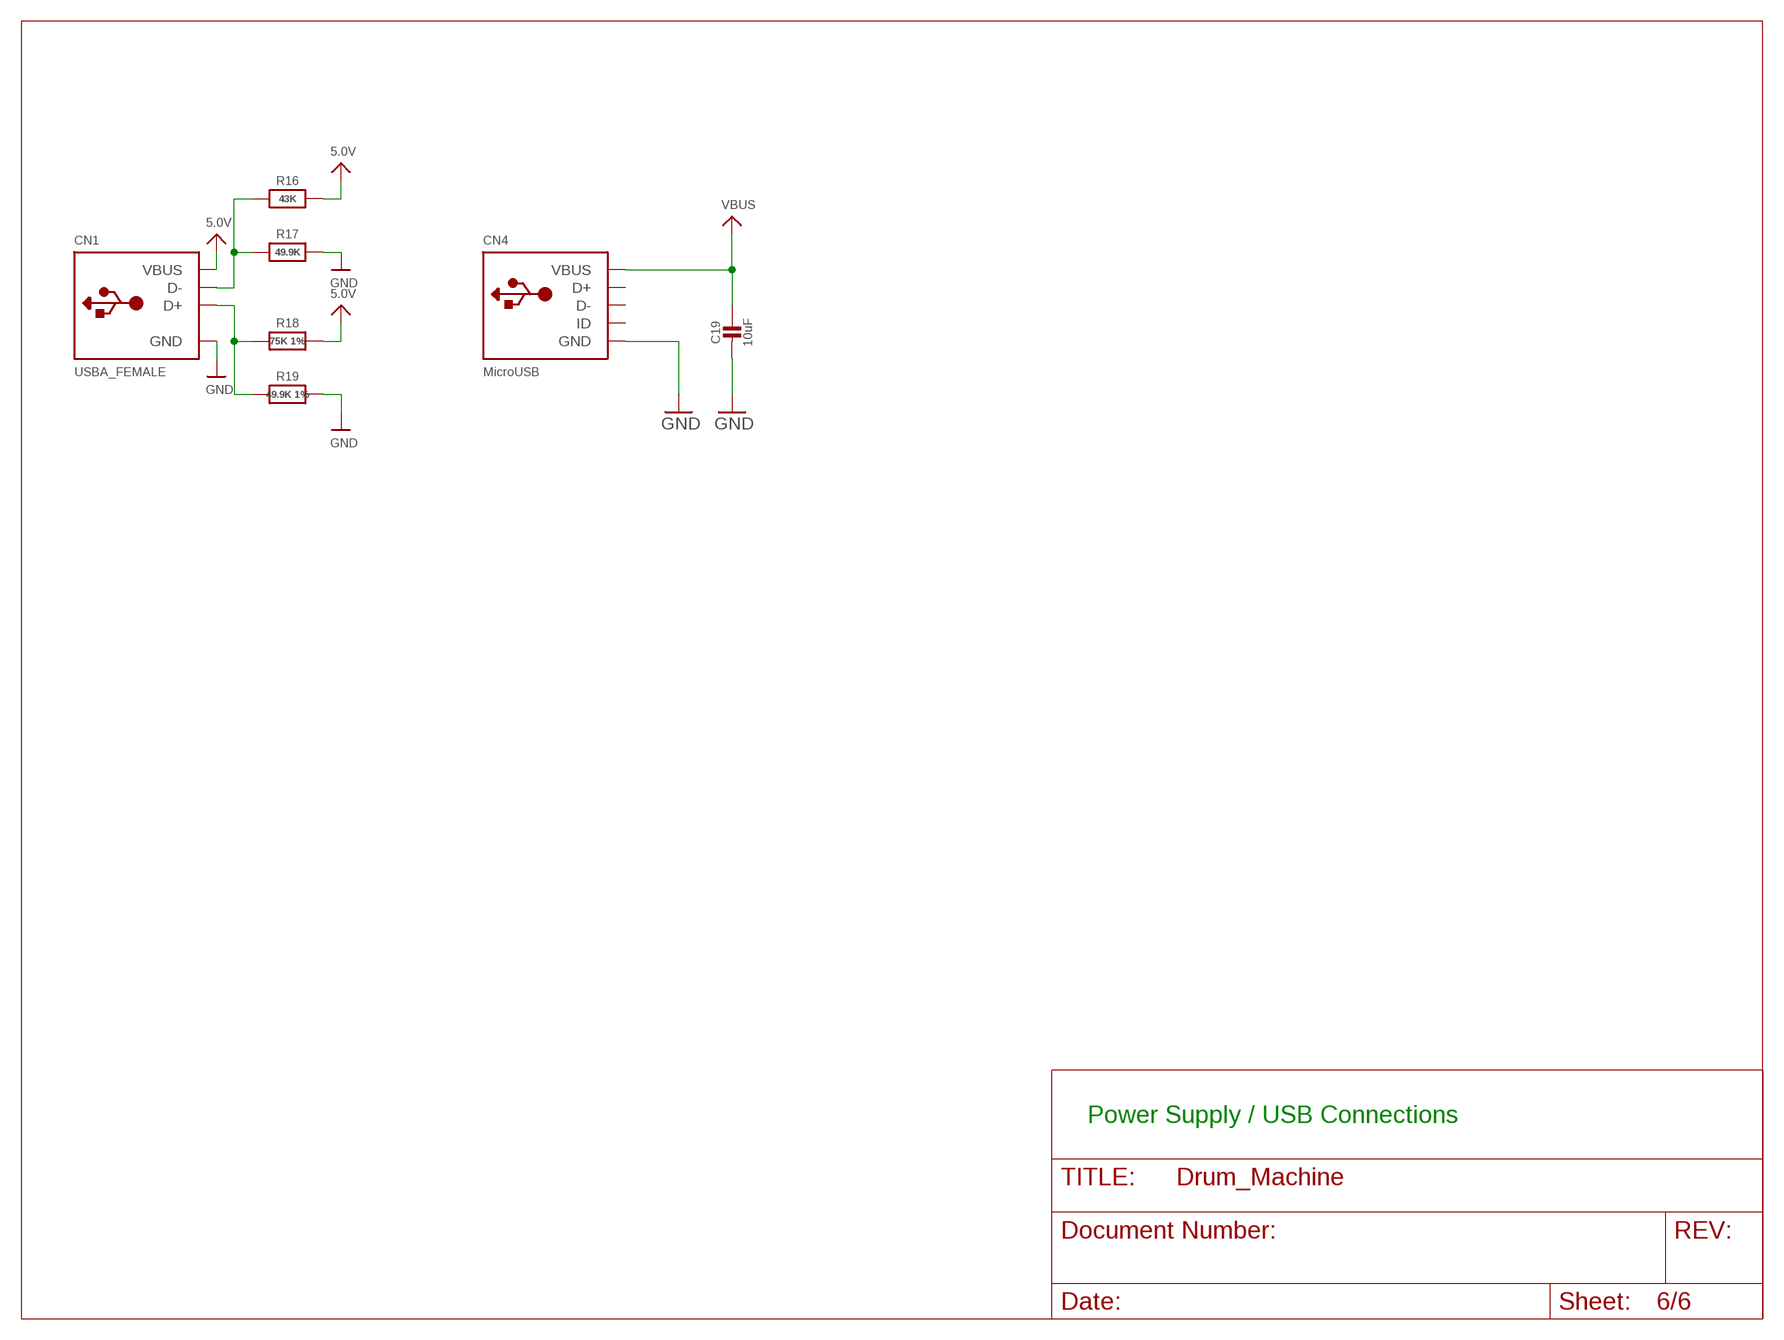
[diagram p5: schematic, sheet 6]

### Parts
C19  10uF  CAP_CERAMIC0805-NOOUTLINE  [0805-NO]
CN1  USBA_FEMALE  USB_TYPEAPTHFML  [USB_HOST-PTH]
CN4  MicroUSB  USBMICRO_20329  [4UCONN_20329]
R16  43K  RESISTOR0805_NOOUTLINE  [0805-NO]
R17  49.9K  RESISTOR0805_NOOUTLINE  [0805-NO]
R18  75K 1%  RESISTOR0805_NOOUTLINE  [0805-NO]
R19  49.9K 1%  RESISTOR0805_NOOUTLINE  [0805-NO]

### Nets
5.0V: CN1.VBUS R16.2 R18.2
D+1: CN1.D+ R18.1 R19.1
D-1: CN1.D- R16.1 R17.1
GND: C19.2 CN1.GND CN4.BASE@1(GND) CN4.BASE@2(GND) CN4.GND CN4.SPRT@1(GND) CN4.SPRT@2(GND) CN4.SPRT@3(GND) CN4.SPRT@4(GND) R17.2 R19.2 ; also sheet 1,2,3,4,5
VBUS: C19.1 CN4.VBUS
Unconnected: CN4.D+ CN4.D- CN4.ID

### Notes on the sheet
- Power Supply / USB Connections

## Library data of the parts
C5 = resistor:C-US: CAPACITOR, American symbol
C19 = microbuilder:CAP_CERAMIC: Ceramic Capacitors For new designs, use the packages preceded by an '_' character since they are more reliable: The following footprints should be used on most boards: _0402 - Standard footprint for regular board layouts _0603 - Standard footprint for regular board layouts _0805 - Standard footprint for regular board layouts _1206 - Standard footprint for regular board layouts For extremely tight-pitch boards where space is at a premium, the following 'micro-pitch' footprints can be used (smaller pads, no silkscreen outline, etc.): _0402MP - Micro-pitch footprint for very dense/compact boards _0603MP - Micro-pitch footprint for very dense/compact boards _0805MP - Micro-pitch footprint for very dense/compact boards _1206MP - Micro-pitch footprint for very dense/compact boards
CN1 = microbuilder:USB_TYPEA: USB - Type A Connectors Male types stick out and are inserted into a PC or matching females parts (these are the connectors used on USB Memory Sticks, etc.). Female parts are generally used for USB Host and accept a male-type connector. SMT - 4UCON: 10017 PTHFML - Digikey: 609-1045-ND, 4UCon: 05241 PCB - Use 2.0mm thick PCBs with this footprint
CN4 = microbuilder:USB: USB Connectors USBMINIB - Surface Mount Female Mini-B USB Connector 4UConnector: 06564
D1-D24 D29-D32 D35-D37 D39 D41-D46 = diode:PMLL4150: DIODE high speed
D40 = SparkFun-LED:LED-RG; PROD_ID: DIO-12140
E1 = SparkFun-Switches:ENCODER-SWITCH: Rotary Encoder w/ Select Switch Encoders rotate similarly to potentiometers, but they’re different from potentiometers in that an encoder has full rotation without limits. They output gray code so that you can tell how much and in which direction the encoder has been turned. This encoder includes a push-down select switch built into the shaft. SparkFun Products Rotary Encoder <https://www.sparkfun.com/products/9117> (COM-09117); SF_SKU: COM-09117
E2-E4 = SparkFun-Switches:ENCODER: Rotary Encoder Encoders rotate similarly to potentiometers, but they’re different from potentiometers in that an encoder has full rotation without limits. They output gray code so that you can tell how much and in which direction the encoder has been turned. SparkFun Products Used on the https://www.sparkfun.com/products/11043 (COM-11043); PROD_ID: RES-11299
IC1-IC4 = Hex Game:74*595: 8-bit SHIFT REGISTER, output latch
IC9 = 74xx-us:74*165: 8-bit parallel load SHIFT REGISTER
J1 = SparkFun-Connectors:USB: USB Connectors USB-B-PTH is fully proven SKU : PRT-00139/CONN-08278 USB-miniB is fully proven SKU : PRT-00587 USB-A-PCB is untested. USB-A-H is throughly reviewed, but untested. Spark Fun Electronics SKU : PRT-00437 USB-B-SMT is throughly reviewed, but untested. Needs silkscreen touching up. USB-A-S has not been used/tested USB-MB-H has not been used/tested USB-MICROB has been used. CONN-09505; PROD_ID: CONN-09520
J2 = SparkFun-Connectors:M10: Header 10 Standard 10-pin 0.1" header. Use with straight break away headers (SKU : PRT-00116), right angle break away headers (PRT-00553), swiss pins (PRT-00743), machine pins (PRT-00117), and female headers (PRT-00115).; PROD_ID: CONN-11563
J5 J6 = con-molex:22-23-2031: .100" (2.54mm) Center Header - 3 Pin; MF: MOLEX; MPN: 22-23-2031; OC_FARNELL: 1462950; OC_NEWARK: 30C0862
LED9-LED64 = Hex Game:LED: LED OSRAM: - CHIPLED LG R971, LG N971, LY N971, LG Q971, LY Q971, LO R971, LY R971 LH N974, LH R974 LS Q976, LO Q976, LY Q976 LO Q996 - Hyper CHIPLED LW Q18S LB Q993, LB Q99A, LB R99A - SideLED LS A670, LO A670, LY A670, LG A670, LP A670 LB A673, LV A673, LT A673, LW A673 LH A674 LY A675 LS A676, LA A676, LO A676, LY A676, LW A676 LS A679, LY A679, LG A679 - Hyper Micro SIDELED® LS Y876, LA Y876, LO Y876, LY Y876 LT Y87S - SmartLED LW L88C, LW L88S LB L89C, LB L89S, LG L890 LS L89K, LO L89K, LY L89K LS L896, LA L896, LO L896, LY L896 - TOPLED LS T670, LO T670, LY T670, LG T670, LP T670 LSG T670, LSP T670, LSY T670, LOP T670, LYG T670 LG T671, LOG T671, LSG T671 LB T673, LV T673, LT T673, LW T673 LH T674 LS T676, LA T676, LO T676, LY T676, LB T676, LH T676, LSB T676, LW T676 LB T67C, LV T67C, LT T67C, LS T67K, LO T67K, LY T67K, LW E67C LS E67B, LA E67B, LO E67B, LY E67B, LB E67C, LV E67C, LT E67C LW T67C LS T679, LY T679, LG T679 LS T770, LO T770, LY T770, LG T770, LP T770 LB T773, LV T773, LT T773, LW T773 LH T774 LS E675, LA E675, LY E675, LS T675 LS T776, LA T776, LO T776, LY T776, LB T776 LHGB T686 LT T68C, LB T68C - Hyper Mini TOPLED® LB M676 - Mini TOPLED Santana® LG M470 LS M47K, LO M47K, LY M47K Source: http://www.osram.convergy.de LUXEON: - LUMILED® LXK2-PW12-R00, LXK2-PW12-S00, LXK2-PW14-U00, LXK2-PW14-V00 LXK2-PM12-R00, LXK2-PM12-S00, LXK2-PM14-U00 LXK2-PE12-Q00, LXK2-PE12-R00, LXK2-PE12-S00, LXK2-PE14-T00, LXK2-PE14-U00 LXK2-PB12-K00, LXK2-PB12-L00, LXK2-PB12-M00, LXK2-PB14-N00, LXK2-PB14-P00, LXK2-PB14-Q00 LXK2-PR12-L00, LXK2-PR12-M00, LXK2-PR14-Q00, LXK2-PR14-R00 LXK2-PD12-Q00, LXK2-PD12-R00, LXK2-PD12-S00 LXK2-PH12-R00, LXK2-PH12-S00 LXK2-PL12-P00, LXK2-PL12-Q00, LXK2-PL12-R00 Source: www.luxeon.com KINGBRIGHT: KA-3528ASYC Source: www.kingbright.com
LED129 = display-kingbright:B?56-12*WA: 14.22mm (0.56INCH) THREE DIGIT NUMERIC DISPLAY Source: http://www.kingbright.com .. BA56-11EWA(Ver1189474895.pdf; OC_FARNELL: unknown; OC_NEWARK: unknown
P1 P2 = pinhead:PINHD-2X18: PIN HEADER
PLAY RECORD SAMPLE_01-SAMPLE_06 STEP_01-STEP_09 STEP_10-STEP_16 STOP = microbuilder:SWITCH_TACT_SMT: SMT Tact Switches 6x6mm - Digikey: P12940SCT-ND KMR2 (4.6x2.8mm) - Digikey: 401-1426-1-ND EVQ-PQHB55 - Light Touch, 160GF (4.5x4.5mm) - Digikey: P8090SCT-ND
Q00 Q01-Q07 Q16-Q18 Q27-Q34 = transistor-pnp:BC857*: PNP Transistror
Q08 Q09 Q10-Q15 Q19-Q26 = transistor-neu-to92:*-NPN-: NPN Transistror
R1-R8 R29-R100 R103-R118 R120 R121 R201-R228 = Hex Game:R-US_: RESISTOR, American symbol
R9-R12 = adafruit:R-US_: RESISTOR, American symbol
R16-R19 = microbuilder:RESISTOR: Resistors For new designs, use the packages preceded by an '_' character since they are more reliable: The following footprints should be used on most boards: _0402 - Standard footprint for regular board layouts _0603 - Standard footprint for regular board layouts _0805 - Standard footprint for regular board layouts _1206 - Standard footprint for regular board layouts For extremely tight-pitch boards where space is at a premium, the following 'micro-pitch' footprints can be used (smaller pads, no silkscreen outline, etc.): _0402MP - Micro-pitch footprint for very dense/compact boards _0603MP - Micro-pitch footprint for very dense/compact boards _0805MP - Micro-pitch footprint for very dense/compact boards _1206MP - Micro-pitch footprint for very dense/compact boards
R101 R102 = rcl:R-EU_: RESISTOR, European symbol; MANEX: 110-0002014
STEP_A STEP_B STEP_C STEP_D = switch:320-916: TOGGLE SWITCH distributor RS Components
U$1 U$2 = Drum_Machine_V00:TRANSDUCER

## Board
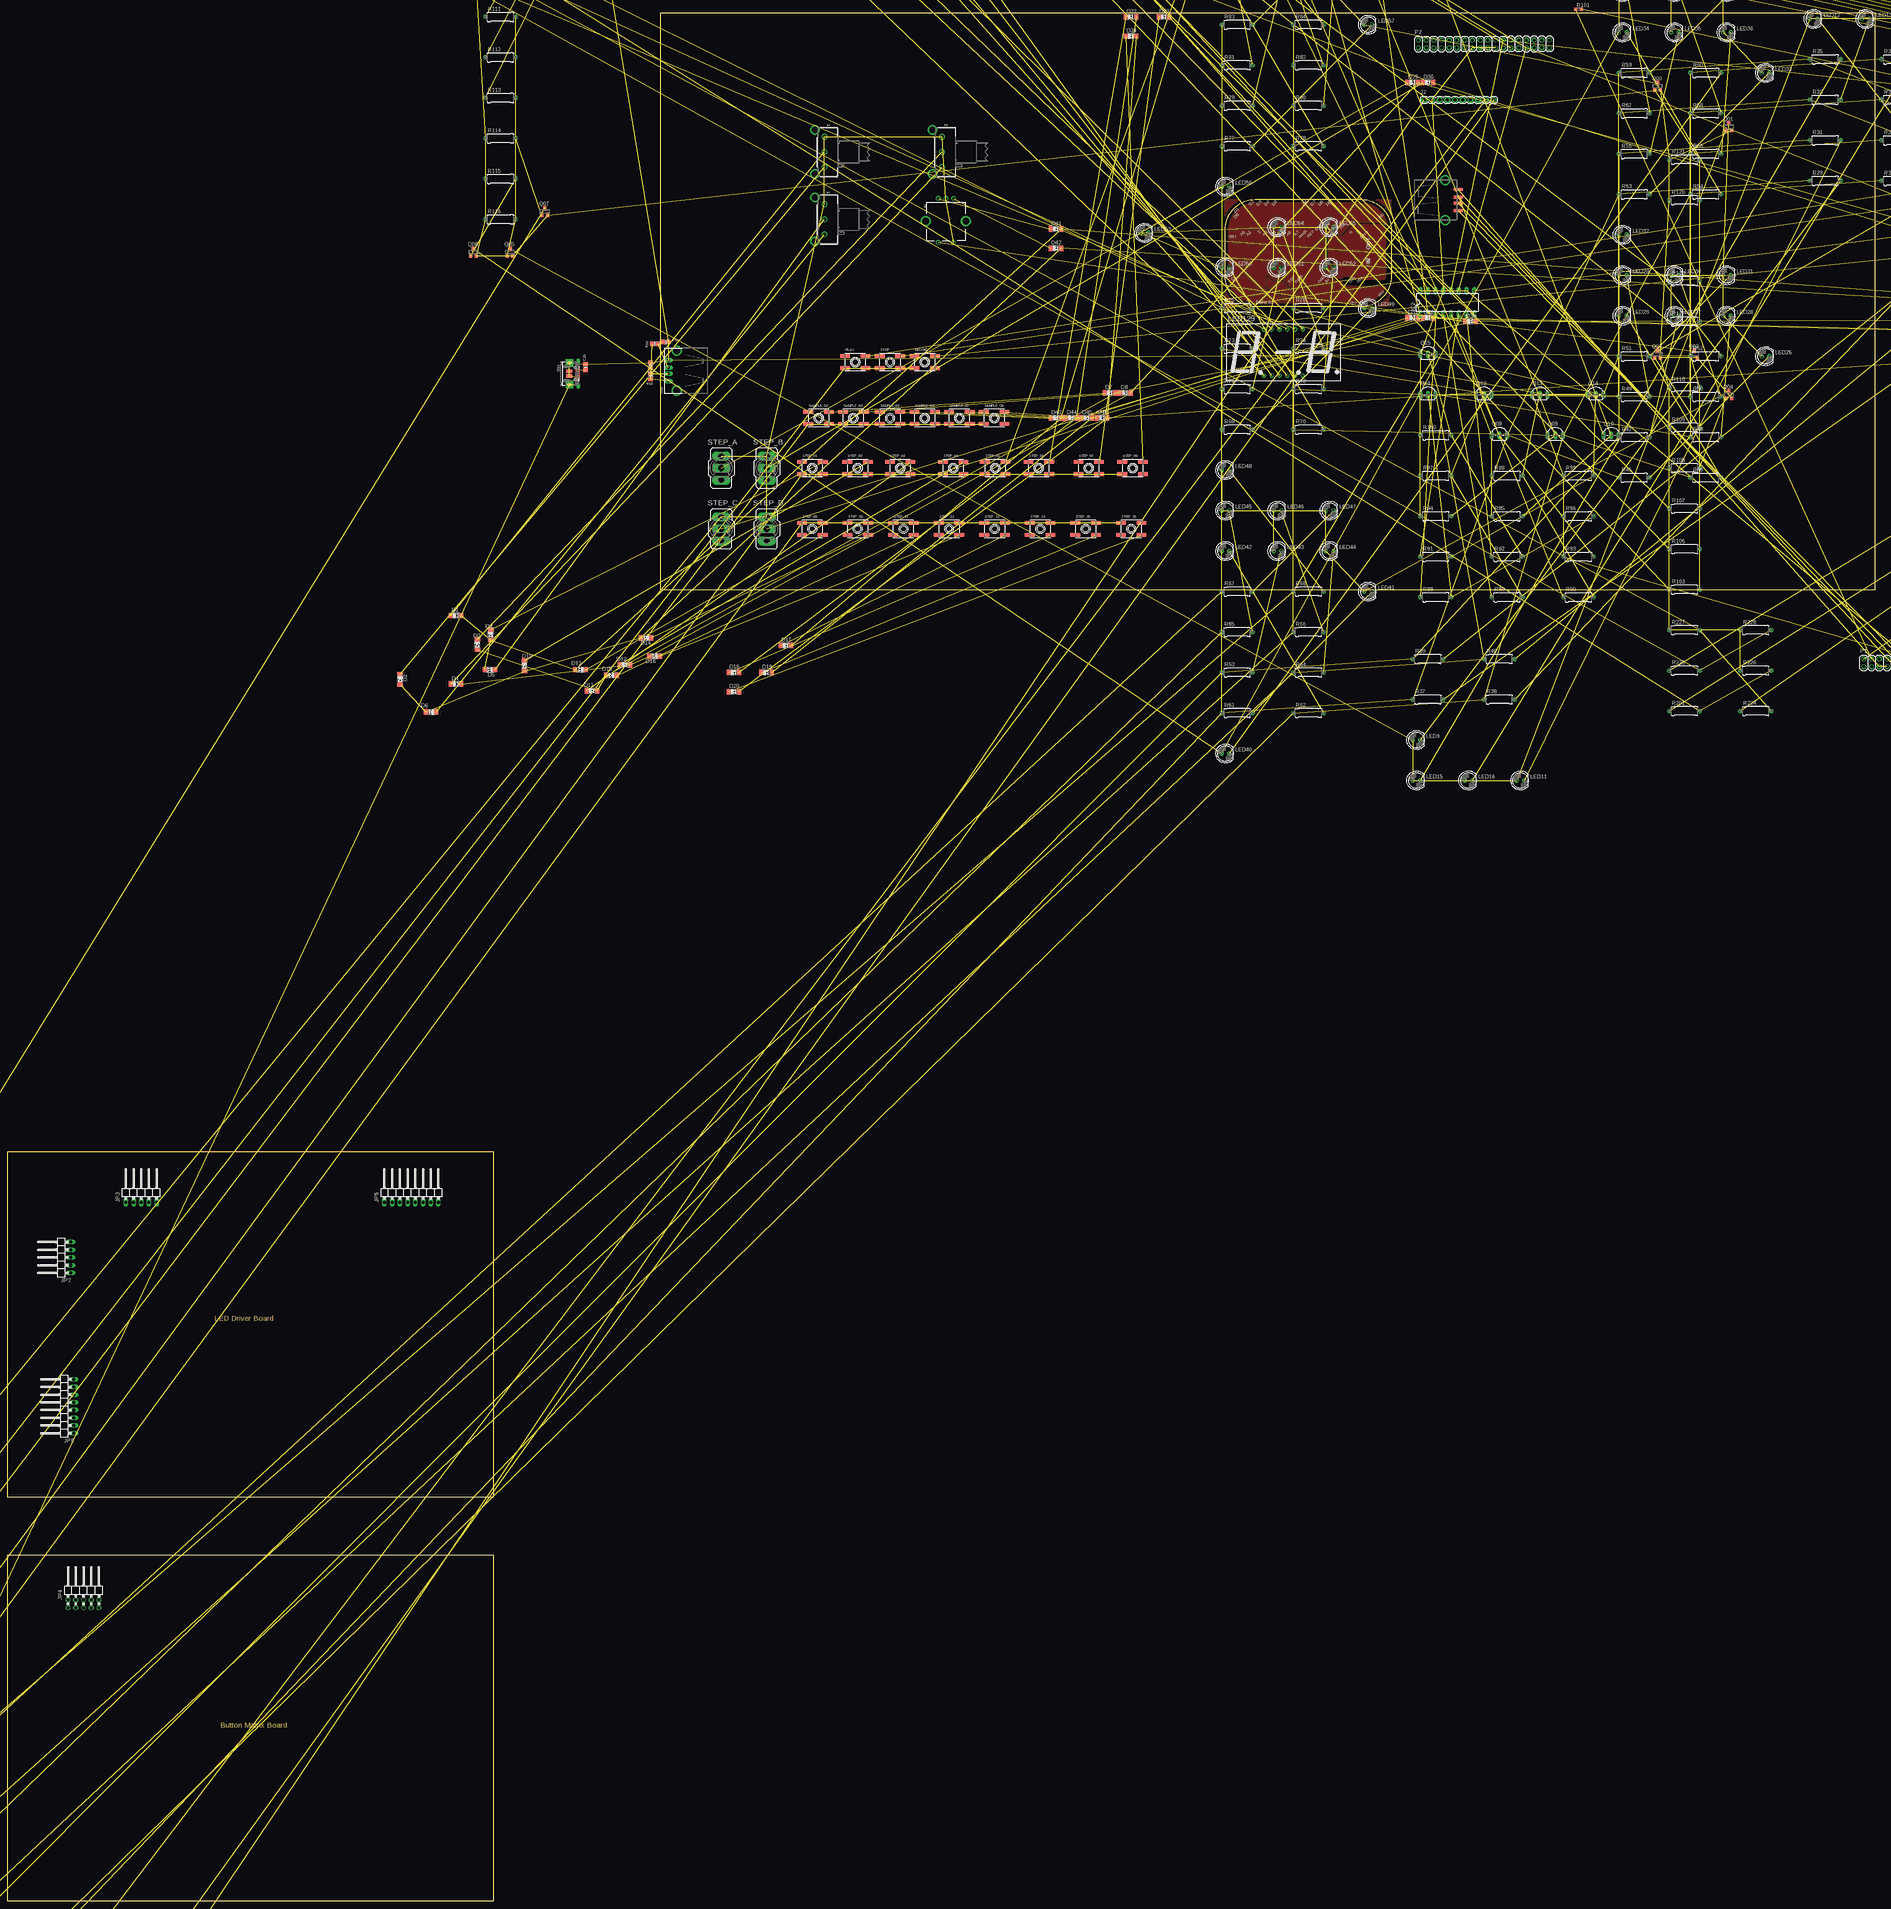
[diagram p6: board, top side]

Size 615 x 622 mm. Coordinates in mm from the lower left corner, seen from the top.
Outline: 215,432 215,622 615,622 615,432 215,432
Outline: 445.8,560.35 410.8,560.35 arc90 400.8,550.35 400.8,535.35 arc90 410.8,525.35 445.8,525.35 arc90 455.8,535.35 455.8,550.35 arc90 445.8,560.35
Outline: 0,247 160,247 160,133 0,133 0,247
Outline: 0,114 160,114 160,0 0,0 0,114
Copper layers (1*16): Top 0.035mm / dielectric 1.5mm / Bottom 0.035mm
Design rules "default": minimum track width 6mil, minimum drill 0.35mm, track to track 6mil, track to pad 6mil, pad to pad 6mil, via to via 6mil, smd to smd 6mil, copper to edge 40mil, drill to drill 6mil, minimum pad ring 10mil, minimum via ring 8mil, stop-mask expansion 4mil, vias tented up to drill 0mil, thermal gap 10mil

### Footprints (pad centres in the part's own frame; a part is rotated, then mirrored left to right if it is on the bottom)
C0805 = smd 1.3 x 1.5: 1 -0.95,0; 2 0.95,0
0805-NO = smd 1.3 x 1.5: 1 -0.95,0; 2 0.95,0
USB_HOST-PTH = drill 0.95 long: D+ 1,6.52; D- -1,6.52; GND 3.5,6.52; VBUS -3.5,6.52 | drill 2.3 pad 2.9: S1 -6.57,3.81; S2 6.57,3.81
4UCONN_20329 = smd 1 x 2: BASE@1 -0.75,-2; BASE@2 0.75,-2 | smd 0.4 x 1.35: D+ 0,0.775; D- -0.65,0.775; GND 1.3,0.775; ID 0.65,0.775; VBUS -1.3,0.775 | drill 0.7 offset: SPRT@1 -3.3,0.9; SPRT@2 3.3,0.9 | drill 0.6 pad 2.5 square: SPRT@3 -3.6,-1.9; SPRT@4 3.6,-1.9 | hole 0.7: -1.95,0; 1.95,0
SOD80C@1 = smd 1.4 x 1.8: A 1.7,0; C -1.7,0
LTST-C195KGJRKT = smd 0.65 x 0.85: P$1 0.425,0.725; P$2 -0.425,0.725; P$3 0.425,-0.725; P$4 -0.425,-0.725
ROTARY_ENC_PLAIN = drill 1.016: A 7.493,-2.54; B 7.493,2.54; C 7.493,0; SW+ -6.985,2.54; SW- -6.985,-2.54 | drill 2.286: P$3 0,6.604; P$4 0,-6.604
ENCODER-16MM-QUAD = drill 1.25: A 0,-5; B 0,0; C 0,5 | drill 2.1: P$1 -3.1,7.2; P$2 -3.1,-7.2
DIL16 = drill 0.813 long: 1 -8.89,-3.81; 2 -6.35,-3.81; 3 -3.81,-3.81; 4 -1.27,-3.81; 5 1.27,-3.81; 6 3.81,-3.81; 7 6.35,-3.81; 8 8.89,-3.81; 9 8.89,3.81; 10 6.35,3.81; 11 3.81,3.81; 12 1.27,3.81; 13 -1.27,3.81; 14 -3.81,3.81; 15 -6.35,3.81; 16 -8.89,3.81
SO16 = smd 0.66 x 2.032: 1 -4.445,-3.073; 2 -3.175,-3.073; 3 -1.905,-3.073; 4 -0.635,-3.073; 5 0.635,-3.073; 6 1.905,-3.073; 7 3.175,-3.073; 8 4.445,-3.073; 9 4.445,3.073; 10 3.175,3.073; 11 1.905,3.073; 12 0.635,3.073; 13 -0.635,3.073; 14 -1.905,3.073; 15 -3.175,3.073; 16 -4.445,3.073
USB-A-S-NOSILK-FEMALE = smd 3 x 0.9: D+ 4.212,-1; D- 4.212,1; GND 4.212,-3.5; VBUS 4.212,3.5 | drill 2.311: S1 0,-6.566; S2 0,6.566
1X10 = drill 1.016 pad 1.88: 1 0,0; 2 2.54,0; 3 5.08,0; 4 7.62,0; 5 10.16,0; 6 12.7,0; 7 15.24,0; 8 17.78,0; 9 20.32,0; 10 22.86,0
22-23-2031 = drill 1 long: 1 -2.54,0; 2 0,0; 3 2.54,0
1X08-3.5MM = drill 1 pad 2.184: 1 -12.25,0; 2 -8.75,0; 3 -5.25,0; 4 -1.75,0; 5 1.75,0; 6 5.25,0; 7 8.75,0; 8 12.25,0
1X05/90 = drill 1.016 long: 1 -5.08,-3.81; 2 -2.54,-3.81; 3 0,-3.81; 4 2.54,-3.81; 5 5.08,-3.81
2X05/90 = drill 1.016 octagon: 1 -5.08,-6.35; 2 -5.08,-3.81; 3 -2.54,-6.35; 4 -2.54,-3.81; 5 0,-6.35; 6 0,-3.81; 7 2.54,-6.35; 8 2.54,-3.81; 9 5.08,-6.35; 10 5.08,-3.81
1X08/90 = drill 1.016 long: 1 -8.89,-3.81; 2 -6.35,-3.81; 3 -3.81,-3.81; 4 -1.27,-3.81; 5 1.27,-3.81; 6 3.81,-3.81; 7 6.35,-3.81; 8 8.89,-3.81
LED5MM = drill 0.813 octagon: A -1.27,0; K 1.27,0
BX56-12 = drill 0.8 pad 1.422: 1 -6.35,-7.62; 2 -3.81,-7.62; 3 -1.27,-7.62; 4 1.27,-7.62; 5 3.81,-7.62; 6 6.35,-7.62; 7 6.35,7.62; 8 3.81,7.62; 9 1.27,7.62; 10 -1.27,7.62; 11 -3.81,7.62; 12 -6.35,7.62
2X18 = drill 1.016 octagon: 1 -21.59,-1.27; 2 -21.59,1.27; 3 -19.05,-1.27; 4 -19.05,1.27; 5 -16.51,-1.27; 6 -16.51,1.27; 7 -13.97,-1.27; 8 -13.97,1.27; 9 -11.43,-1.27; 10 -11.43,1.27; 11 -8.89,-1.27; 12 -8.89,1.27; 13 -6.35,-1.27; 14 -6.35,1.27; 15 -3.81,-1.27; 16 -3.81,1.27; 17 -1.27,-1.27; 18 -1.27,1.27; 19 1.27,-1.27; 20 1.27,1.27; 21 3.81,-1.27; 22 3.81,1.27; 23 6.35,-1.27; 24 6.35,1.27; 25 8.89,-1.27; 26 8.89,1.27; 27 11.43,-1.27; 28 11.43,1.27; 29 13.97,-1.27; 30 13.97,1.27; 31 16.51,-1.27; 32 16.51,1.27; 33 19.05,-1.27; 34 19.05,1.27; 35 21.59,-1.27; 36 21.59,1.27
EVQ-Q2 = smd 3.2 x 1.2: A -3.4,-2; A' 3.4,-2; B -3.4,2; B' 3.4,2
SOT23-BEC = smd 1 x 1.4: B -0.95,-1.1; C 0,1.1; E 0.95,-1.1
TO92-EBC = drill 0.813 long: B 0,-1.27; C 2.54,-1.27; E -2.54,-1.27
0309/10 = drill 0.813 octagon: 1 -5.08,0; 2 5.08,0
0204/5 = drill 0.813 pad 1.676 octagon: 1 -2.54,0; 2 2.54,0
R0603 = smd 1 x 1.1: 1 -0.85,0; 2 0.85,0
320-916 = drill 2.007 long: 1 0,4.013; 2 0,0; 3 0,-4.013
DIAPHRAGM = smd 1.27 x 1.27: + 16.51,1.27; - 22.86,-6.35

### Placement (x,y rotation side)
C5  736.97,527.25 0 top  (outside the outline)
C19  190.36,505.28 90 top
CN1  224.14,504.07 90 top
CN4  186.93,503.12 270 top
D1  147.69,423.43 0 top
D2  129.28,402.47 270 top
D3  154.68,413.9 270 top
D4  147.69,400.88 0 top
D5  158.8,405.65 180 top
D6  139.44,391.68 180 top
D7  362.95,496.77 0 top
D8  368.04,496.77 0 top
D9  159.12,417.08 270 top
D10  170.23,406.92 270 top
D11  192.46,398.66 0 top
D12  203.25,407.24 0 top
D13  188.65,405.65 180 top
D14  210.24,416.12 180 top
D15  198.81,403.74 180 top
D16  213.09,410.09 180 top
D17  256.27,413.58 0 top
D18  239.13,404.69 0 top
D19  249.93,404.69 0 top
D20  239.13,398.35 0 top
D21  387.08,629.49 0 top  (outside the outline)
D22  369.94,620.6 0 top
D23  380.74,620.6 0 top
D24  369.94,614.25 0 top
D29  462.65,599 0 top
D30  467.73,599 0 top
D31  462.65,521.54 0 top
D32  467.73,521.54 0 top
D35  785.23,588.21 0 top  (outside the outline)
D36  785.23,581.86 0 top  (outside the outline)
D37  785.23,557.73 0 top  (outside the outline)
D39  481.7,520.26 0 top
D40  824.6,557.73 0 top  (outside the outline)
D41  345.18,550.75 0 top
D42  345.18,544.39 0 top
D43  345.18,488.51 0 top
D44  350.25,488.51 0 top
D45  355.33,488.51 0 top
D46  360.42,488.51 0 top
E1  308.98,553.29 90 top
E2  268.98,553.92 0 top
E3  268.98,576.14 0 top
E4  307.71,576.14 0 top
IC1  244.21,760.93 0 top  (outside the outline)
IC2  474.08,526.62 0 top
IC3  832.86,571.07 0 top  (outside the outline)
IC4  863.97,571.07 0 top  (outside the outline)
IC9  742.05,517.73 0 top  (outside the outline)
J1  473.44,560.27 0 top
J2  466.46,593.29 0 top
J5  -51,425 0 top  (outside the outline)
J6  -51,409 0 top  (outside the outline)
JP1  [1X08-3.5MM]  -38,390 0 top  (outside the outline)
JP2  [1X05/90]  17,212 90 top
JP3  [1X05/90]  44,234 0 top
JP4  [2X05/90]  25,103 0 top
JP5  [1X08/90]  133,234 0 top
JP6  [1X08/90]  18,163 90 top
LED9  463.92,382.47 0 top
LED10  641.72,606.62 0 top  (outside the outline)
LED11  498.21,369.13 0 top
LED12  594.73,619.96 0 top
LED13  611.88,619.96 0 top
LED14  629.02,619.96 0 top  (outside the outline)
LED15  463.92,369.13 0 top
LED16  481.06,369.13 0 top
LED17  724.9,574.24 0 top  (outside the outline)
LED18  677.91,587.58 0 top  (outside the outline)
LED19  695.06,587.58 0 top  (outside the outline)
LED20  712.21,587.58 0 top  (outside the outline)
LED21  677.91,600.91 0 top  (outside the outline)
LED22  695.06,600.91 0 top  (outside the outline)
LED23  712.21,600.91 0 top  (outside the outline)
LED24  677.91,614.25 0 top  (outside the outline)
LED25  578.86,508.83 0 top
LED26  531.87,522.17 0 top
LED27  549.01,522.17 0 top
LED28  566.15,522.17 0 top
LED29  531.87,535.5 0 top
LED30  549.01,535.5 0 top
LED31  566.15,535.5 0 top
LED32  531.87,548.84 0 top
LED33  578.86,602.18 0 top
LED34  531.87,615.51 0 top
LED35  549.01,615.51 0 top
LED36  566.15,615.51 0 top
LED37  531.87,628.85 0 top  (outside the outline)
LED38  549.01,628.85 0 top  (outside the outline)
LED39  566.15,628.85 0 top  (outside the outline)
LED40  401.06,378.02 0 top
LED41  448.05,431.37 0 top
LED42  401.06,444.7 0 top
LED43  418.2,444.7 0 top
LED44  435.35,444.7 0 top
LED45  401.06,458.04 0 top
LED46  418.2,458.04 0 top
LED47  435.35,458.04 0 top
LED48  401.06,471.37 0 top
LED49  448.05,524.71 0 top
LED50  401.06,538.05 0 top
LED51  418.2,538.05 0 top
LED52  435.35,538.05 0 top
LED53  374.38,549.48 0 top
LED54  418.2,551.38 0 top
LED55  435.35,551.38 0 top
LED56  401.06,564.71 0 top
LED57  448.05,618.06 0 top
LED58  401.06,631.39 0 top  (outside the outline)
LED59  418.2,631.39 0 top  (outside the outline)
LED60  435.35,631.39 0 top  (outside the outline)
LED61  401.06,644.73 0 top  (outside the outline)
LED62  418.2,644.73 0 top  (outside the outline)
LED63  435.35,644.73 0 top  (outside the outline)
LED64  401.06,658.06 0 top  (outside the outline)
LED129  420.11,510.11 0 top
P1  632.83,407.87 0 top
P2  486.14,611.7 0 top
PLAY  279.13,506.93 0 top
Q00  543.29,597.74 0 top
Q01  566.79,584.4 0 top
Q02  555.36,509.47 0 top
Q03  543.29,509.47 0 top
Q04  566.79,496.13 0 top
Q05  165.47,543.12 0 top
Q06  153.41,543.12 0 top
Q07  176.9,556.46 0 top
Q08  491.23,484.07 0 top
Q09  509.64,484.07 0 top
Q10  528.05,484.07 0 top
Q11  467.73,497.4 0 top
Q12  486.14,497.4 0 top
Q13  504.56,497.4 0 top
Q14  522.98,497.4 0 top
Q15  467.73,510.74 0 top
Q16  153.41,631.39 0 top  (outside the outline)
Q17  153.41,639.01 0 top  (outside the outline)
Q18  153.41,646.63 0 top  (outside the outline)
Q19  159.75,672.03 0 top  (outside the outline)
Q20  178.17,672.03 0 top  (outside the outline)
Q21  196.59,672.03 0 top  (outside the outline)
Q22  215,672.03 0 top  (outside the outline)
Q23  233.41,672.03 0 top  (outside the outline)
Q24  159.75,658.7 0 top  (outside the outline)
Q25  178.17,658.7 0 top  (outside the outline)
Q26  196.59,658.7 0 top  (outside the outline)
Q27  -257,-144 0 top  (outside the outline)
Q28  -257,-180 0 top  (outside the outline)
Q29  -257,-202 0 top  (outside the outline)
Q30  -257,-238 0 top  (outside the outline)
Q31  -245,-238 0 top  (outside the outline)
Q32  -257,-260 0 top  (outside the outline)
Q33  -257,-282 0 top  (outside the outline)
Q34  -257,-304 0 top  (outside the outline)
R1  -248,-155 0 top  (outside the outline)
R2  -248,-169 0 top  (outside the outline)
R3  -248,-191 0 top  (outside the outline)
R4  -248,-213 0 top  (outside the outline)
R5  -248,-227 0 top  (outside the outline)
R6  -248,-249 0 top  (outside the outline)
R7  -248,-271 0 top  (outside the outline)
R8  -248,-293 0 top  (outside the outline)
R9  -249,-426 0 top  (outside the outline)
R10  -249,-443 0 top  (outside the outline)
R11  -249,-460 0 top  (outside the outline)
R12  -249,-477 0 top  (outside the outline)
R16  211.75,502.23 270 top
R17  211.73,505.85 90 top
R18  213.22,512.9 180 top
R19  216.65,513.53 0 top
R29  598.54,566.62 0 top
R30  622.03,566.62 0 top
R31  598.54,579.95 0 top
R32  622.03,579.95 0 top
R33  598.54,593.29 0 top
R34  622.03,593.29 0 top
R35  598.54,606.62 0 top
R36  622.03,606.62 0 top
R37  467.73,395.81 0 top
R38  491.23,395.81 0 top
R39  467.73,409.14 0 top
R40  491.23,409.14 0 top
R41  681.73,560.9 0 top  (outside the outline)
R42  705.22,560.9 0 top  (outside the outline)
R43  681.73,574.24 0 top  (outside the outline)
R44  705.22,574.24 0 top  (outside the outline)
R45  535.67,468.83 0 top
R46  559.17,468.83 0 top
R47  535.67,482.17 0 top
R48  559.17,482.17 0 top
R49  535.67,495.5 0 top
R50  559.17,495.5 0 top
R51  535.67,508.83 0 top
R52  559.17,508.83 0 top
R53  535.67,562.17 0 top
R54  559.17,562.17 0 top
R55  535.67,575.51 0 top
R56  559.17,575.51 0 top
R57  535.67,588.85 0 top
R58  559.17,588.85 0 top
R59  535.67,602.18 0 top
R60  559.17,602.18 0 top
R61  404.87,391.36 0 top
R62  428.36,391.36 0 top
R63  404.87,404.69 0 top
R64  428.36,404.69 0 top
R65  404.87,418.03 0 top
R66  428.36,418.03 0 top
R67  404.87,431.37 0 top
R68  428.36,431.37 0 top
R69  404.87,484.7 0 top
R70  428.36,484.7 0 top
R71  404.87,498.04 0 top
R72  428.36,498.04 0 top
R73  404.87,511.38 0 top
R74  428.36,511.38 0 top
R75  404.87,524.71 0 top
R76  428.36,524.71 0 top
R77  404.87,578.05 0 top
R78  428.36,578.05 0 top
R79  404.87,591.38 0 top
R80  428.36,591.38 0 top
R81  404.87,604.72 0 top
R82  428.36,604.72 0 top
R83  404.87,618.06 0 top
R84  428.36,618.06 0 top
R85  404.87,671.39 0 top  (outside the outline)
R86  428.36,671.39 0 top  (outside the outline)
R87  451.86,671.39 0 top  (outside the outline)
R88  470.27,429.46 0 top
R89  493.76,429.46 0 top
R90  517.26,429.46 0 top
R91  470.27,442.8 0 top
R92  493.76,442.8 0 top
R93  517.26,442.8 0 top
R94  470.27,456.13 0 top
R95  493.76,456.13 0 top
R96  517.26,456.13 0 top
R97  470.27,469.46 0 top
R98  493.76,469.46 0 top
R99  517.26,469.46 0 top
R100  470.27,482.8 0 top
R101  517.26,623.13 0 top
R102  818.88,557.73 0 top  (outside the outline)
R103  552.18,432 0 top
R104  162.29,750.77 0 top  (outside the outline)
R105  185.79,750.77 0 top  (outside the outline)
R106  552.18,445.33 0 top
R107  552.18,458.67 0 top
R108  552.18,472 0 top
R109  552.18,485.34 0 top
R110  552.18,498.68 0 top
R111  162.29,620.6 0 top
R112  162.29,607.26 0 top
R113  162.29,593.92 0 top
R114  162.29,580.59 0 top
R115  162.29,567.25 0 top
R116  162.29,553.92 0 top
R117  552.18,520.26 0 top
R118  552.18,533.6 0 top
R120  552.18,560.27 0 top
R121  552.18,573.61 0 top
R201  552.18,392 0 top
R202  209.28,750.77 0 top  (outside the outline)
R203  232.78,750.77 0 top  (outside the outline)
R204  162.29,737.43 0 top  (outside the outline)
R205  185.79,737.43 0 top  (outside the outline)
R206  209.28,737.43 0 top  (outside the outline)
R207  232.78,737.43 0 top  (outside the outline)
R208  162.29,724.1 0 top  (outside the outline)
R209  185.79,724.1 0 top  (outside the outline)
R210  209.28,724.1 0 top  (outside the outline)
R211  232.78,724.1 0 top  (outside the outline)
R212  162.29,710.76 0 top  (outside the outline)
R213  185.79,710.76 0 top  (outside the outline)
R214  209.28,710.76 0 top  (outside the outline)
R215  232.78,710.76 0 top  (outside the outline)
R216  162.29,697.43 0 top  (outside the outline)
R217  185.79,697.43 0 top  (outside the outline)
R218  209.28,697.43 0 top  (outside the outline)
R219  232.78,697.43 0 top  (outside the outline)
R220  162.29,684.1 0 top  (outside the outline)
R221  185.79,684.1 0 top  (outside the outline)
R222  209.28,684.1 0 top  (outside the outline)
R223  232.78,684.1 0 top  (outside the outline)
R224  575.68,392 0 top
R225  552.18,405.33 0 top
R226  575.68,405.33 0 top
R227  552.18,418.67 0 top
R228  575.68,418.67 0 top
RECORD  302,506.93 0 top
SAMPLE_01  267.07,488.51 0 top
SAMPLE_02  278.5,488.51 0 top
SAMPLE_03  290.56,488.51 0 top
SAMPLE_04  302,488.51 0 top
SAMPLE_05  313.43,488.51 0 top
SAMPLE_06  324.86,488.51 0 top
STEP_01  265,472 0 top
STEP_02  279.88,472 0 top
STEP_03  293.94,472 0 top
STEP_04  311.38,472 0 top
STEP_05  325.17,472 0 top
STEP_06  339.6,472 0 top
STEP_07  356.03,472 0 top
STEP_08  370.46,472 0 top
STEP_09  265,452 0 top
STEP_10  280,452 0 top
STEP_11  295,452 0 top
STEP_12  310,452 0 top
STEP_13  325,452 0 top
STEP_14  340,452 0 top
STEP_15  355,452 0 top
STEP_16  370,452 0 top
STEP_A  235,472 0 top
STEP_B  250,472 0 top
STEP_C  235,452 0 top
STEP_D  250,452 0 top
STOP  290.56,506.93 0 top
U$1  -233,-335 0 top  (outside the outline)
U$2  -233,-390 0 top  (outside the outline)

### Tracks (layer width: path | path; a pad name or v marks a point on that pad's centre or on a via)
3.3V  (10 unrouted)
5.0V  (2 unrouted)
5V  (21 unrouted)
7SEG_A  (1 unrouted)
7SEG_B  (1 unrouted)
7SEG_C  (1 unrouted)
7SEG_CA1  (1 unrouted)
7SEG_CA2  (1 unrouted)
7SEG_CA3  (1 unrouted)
7SEG_D  (1 unrouted)
7SEG_DP  (1 unrouted)
7SEG_E  (1 unrouted)
7SEG_F  (1 unrouted)
7SEG_G  (1 unrouted)
7SEG_SR_A  (1 unrouted)
7SEG_SR_B  (1 unrouted)
7SEG_SR_C  (1 unrouted)
7SEG_SR_CA1  (1 unrouted)
7SEG_SR_CA2  (1 unrouted)
7SEG_SR_CA3  (1 unrouted)
7SEG_SR_D  (1 unrouted)
7SEG_SR_DP  (1 unrouted)
7SEG_SR_E  (1 unrouted)
7SEG_SR_F  (1 unrouted)
7SEG_SR_G  (1 unrouted)
4445  (2 unrouted)
CLOCK  (5 unrouted)
D+1  (2 unrouted)
D-1  (2 unrouted)
DATA_DISPLAY  (1 unrouted)
DATA_OUT  (1 unrouted)
E1_A  (1 unrouted)
E1_B  (1 unrouted)
E1_SW  (1 unrouted)
E2_A  (1 unrouted)
E2_B  (1 unrouted)
E3_A  (1 unrouted)
E3_B  (1 unrouted)
E4_A  (1 unrouted)
E4_B  (1 unrouted)
GND  (65 unrouted)
  pour Top (isolate 0.203): 434.84,548.59 439.66,548.59 443.47,552.4 452.11,552.4 453.63,550.87 453.63,534.62 453.12,534.11 443.47,534.11 442.46,535.12 439.92,535.12 439.15,534.36 437.88,534.36 436.87,535.38 436.87,539.44 434.84,541.47
  pour Top (isolate 0.203, rank 2): 439.15,549.09 443.09,553.03 452.74,553.03 453.38,552.4 455.67,552.4 455.67,560.27 400.8,560.27 400.8,525.22 454.9,525.47 454.9,531.82 440.68,531.82 438.9,533.6 437.38,533.6 436.11,534.87 436.11,538.93 434.07,540.97 434.07,548.33 434.84,549.09
IN_COL_00  (5 unrouted)
IN_COL_01  (5 unrouted)
IN_COL_02  (5 unrouted)
IN_COL_03  (5 unrouted)
IN_COL_04  (5 unrouted)
IN_COL_05  (5 unrouted)
IN_COL_06  (5 unrouted)
IN_COL_07  (3 unrouted)
IN_ROW_00  (9 unrouted)
IN_ROW_01  (3 unrouted)
IN_ROW_02  (6 unrouted)
IN_ROW_03  (8 unrouted)
IN_ROW_04  (8 unrouted)
LATCH  (4 unrouted)
N$2  (1 unrouted)
N$3  (1 unrouted)
N$4  (1 unrouted)
N$5  (1 unrouted)
N$6  (1 unrouted)
N$7  (1 unrouted)
N$8  (1 unrouted)
N$9  (1 unrouted)
N$10  (1 unrouted)
N$11  (1 unrouted)
N$12  (1 unrouted)
N$13  (1 unrouted)
N$14  (1 unrouted)
N$15  (1 unrouted)
N$16  (1 unrouted)
N$17  (1 unrouted)
N$18  (1 unrouted)
N$19  (1 unrouted)
N$20  (1 unrouted)
N$21  (1 unrouted)
N$22  (1 unrouted)
N$23  (8 unrouted)
N$24  (1 unrouted)
N$25  (2 unrouted)
N$26  (1 unrouted)
N$27  (1 unrouted)
N$28  (1 unrouted)
N$29  (1 unrouted)
N$31  (1 unrouted)
N$32  (1 unrouted)
N$33  (1 unrouted)
N$34  (1 unrouted)
N$36  (1 unrouted)
N$37  (8 unrouted)
N$40  (1 unrouted)
N$41  (1 unrouted)
N$43  (1 unrouted)
N$45  (1 unrouted)
N$47  (1 unrouted)
N$49  (1 unrouted)
N$51  (1 unrouted)
N$58  (1 unrouted)
N$59  (1 unrouted)
N$60  (1 unrouted)
N$61  (8 unrouted)
N$62  (1 unrouted)
N$63  (1 unrouted)
N$64  (1 unrouted)
N$65  (1 unrouted)
N$66  (1 unrouted)
N$67  (1 unrouted)
N$68  (1 unrouted)
N$69  (1 unrouted)
N$70  (8 unrouted)
N$71  (1 unrouted)
N$72  (1 unrouted)
N$73  (1 unrouted)
N$74  (1 unrouted)
N$75  (1 unrouted)
N$76  (1 unrouted)
N$77  (1 unrouted)
N$78  (1 unrouted)
N$79  (8 unrouted)
N$80  (1 unrouted)
N$81  (1 unrouted)
N$82  (1 unrouted)
N$83  (1 unrouted)
N$84  (1 unrouted)
N$85  (1 unrouted)
N$86  (1 unrouted)
N$87  (1 unrouted)
N$88  (8 unrouted)
N$89  (1 unrouted)
N$90  (1 unrouted)
N$91  (1 unrouted)
N$92  (1 unrouted)
N$93  (1 unrouted)
N$94  (1 unrouted)
N$95  (1 unrouted)
N$96  (1 unrouted)
N$97  (8 unrouted)
N$98  (1 unrouted)
N$99  (1 unrouted)
N$100  (1 unrouted)
N$101  (1 unrouted)
N$102  (1 unrouted)
N$103  (1 unrouted)
N$104  (1 unrouted)
N$105  (1 unrouted)
N$106  (8 unrouted)
N$107  (1 unrouted)
N$108  (1 unrouted)
N$109  (1 unrouted)
N$110  (1 unrouted)
N$111  (1 unrouted)
N$112  (1 unrouted)
N$113  (1 unrouted)
N$114  (1 unrouted)
N$115  (8 unrouted)
N$116  (8 unrouted)
N$117  (8 unrouted)
N$118  (8 unrouted)
N$119  (8 unrouted)
N$120  (8 unrouted)
N$121  (8 unrouted)
N$122  (8 unrouted)
N$123  (2 unrouted)
N$124  (1 unrouted)
N$125  (2 unrouted)
N$126  (2 unrouted)
N$127  (2 unrouted)
N$128  (2 unrouted)
N$129  (2 unrouted)
N$130  (2 unrouted)
N$131  (2 unrouted)
N$132  (1 unrouted)
N$133  (2 unrouted)
N$134  (1 unrouted)
N$135  (1 unrouted)
N$136  (1 unrouted)
N$137  (1 unrouted)
N$138  (2 unrouted)
N$139  (2 unrouted)
N$140  (2 unrouted)
N$142  (2 unrouted)
N$143  (2 unrouted)
N$144  (2 unrouted)
N$145  (1 unrouted)
N$146  (1 unrouted)
N$147  (1 unrouted)
N$148  (1 unrouted)
N$149  (1 unrouted)
N$238  (2 unrouted)
N$241  (1 unrouted)
N$242  (1 unrouted)
N$243  (1 unrouted)
N$244  (1 unrouted)
N$245  (1 unrouted)
N$246  (1 unrouted)
N$247  (1 unrouted)
N$248  (1 unrouted)
N$249  (2 unrouted)
N$250  (2 unrouted)
N$251  (2 unrouted)
N$252  (2 unrouted)
N$253  (2 unrouted)
N$254  (2 unrouted)
N$255  (2 unrouted)
N$256  (2 unrouted)
N$258  (2 unrouted)
N$259  (2 unrouted)
OUT_COL_00  (1 unrouted)
OUT_COL_01  (1 unrouted)
OUT_COL_02  (1 unrouted)
OUT_COL_03  (1 unrouted)
OUT_COL_04  (1 unrouted)
OUT_COL_05  (1 unrouted)
OUT_COL_06  (1 unrouted)
OUT_COL_07  (1 unrouted)
OUT_ROW_00  (1 unrouted)
OUT_ROW_01  (1 unrouted)
OUT_ROW_02  (1 unrouted)
OUT_ROW_03  (1 unrouted)
OUT_ROW_04  (1 unrouted)
OUT_ROW_05  (1 unrouted)
OUT_ROW_06  (1 unrouted)
OUT_ROW_07  (1 unrouted)
PIEZO_00  (3 unrouted)
PIEZO_01  (3 unrouted)
USB_DM1  (1 unrouted)
USB_DP1  (1 unrouted)
USB_VBUS1  (2 unrouted)
USBGND
  pour Top: 414.64,534.62 414.64,531.95 416.42,530.17 418.07,530.17 419.34,528.9 424.55,528.9 424.55,530.42 424.17,530.81 422.52,530.81 419.98,533.35 416.42,533.35 414.9,534.87
USBGND1  (2 unrouted)
VBUS  (1 unrouted)
VREF  (2 unrouted)

### Text on the board
Dimension: LED Driver Board | Button Matrix Board
tPlace: D1 | D2 | D3 | D4 | D5 | D6 | D7 | D8 | D9 | D0 | D12 | GND | 3.3V | D10 | D11 | A0 | A1 | 2 | A3 | A4 | A5 | A6 | A7 | GND | REF | R | L | GND | OUT | IN | 3.3V | GND | GND | 5V | D15 | D14 | D13 | bela.io | rev. B2
tNames: SW1 | D5